# EasyEDA Pro project 40_keyboard.epro, board PCB7
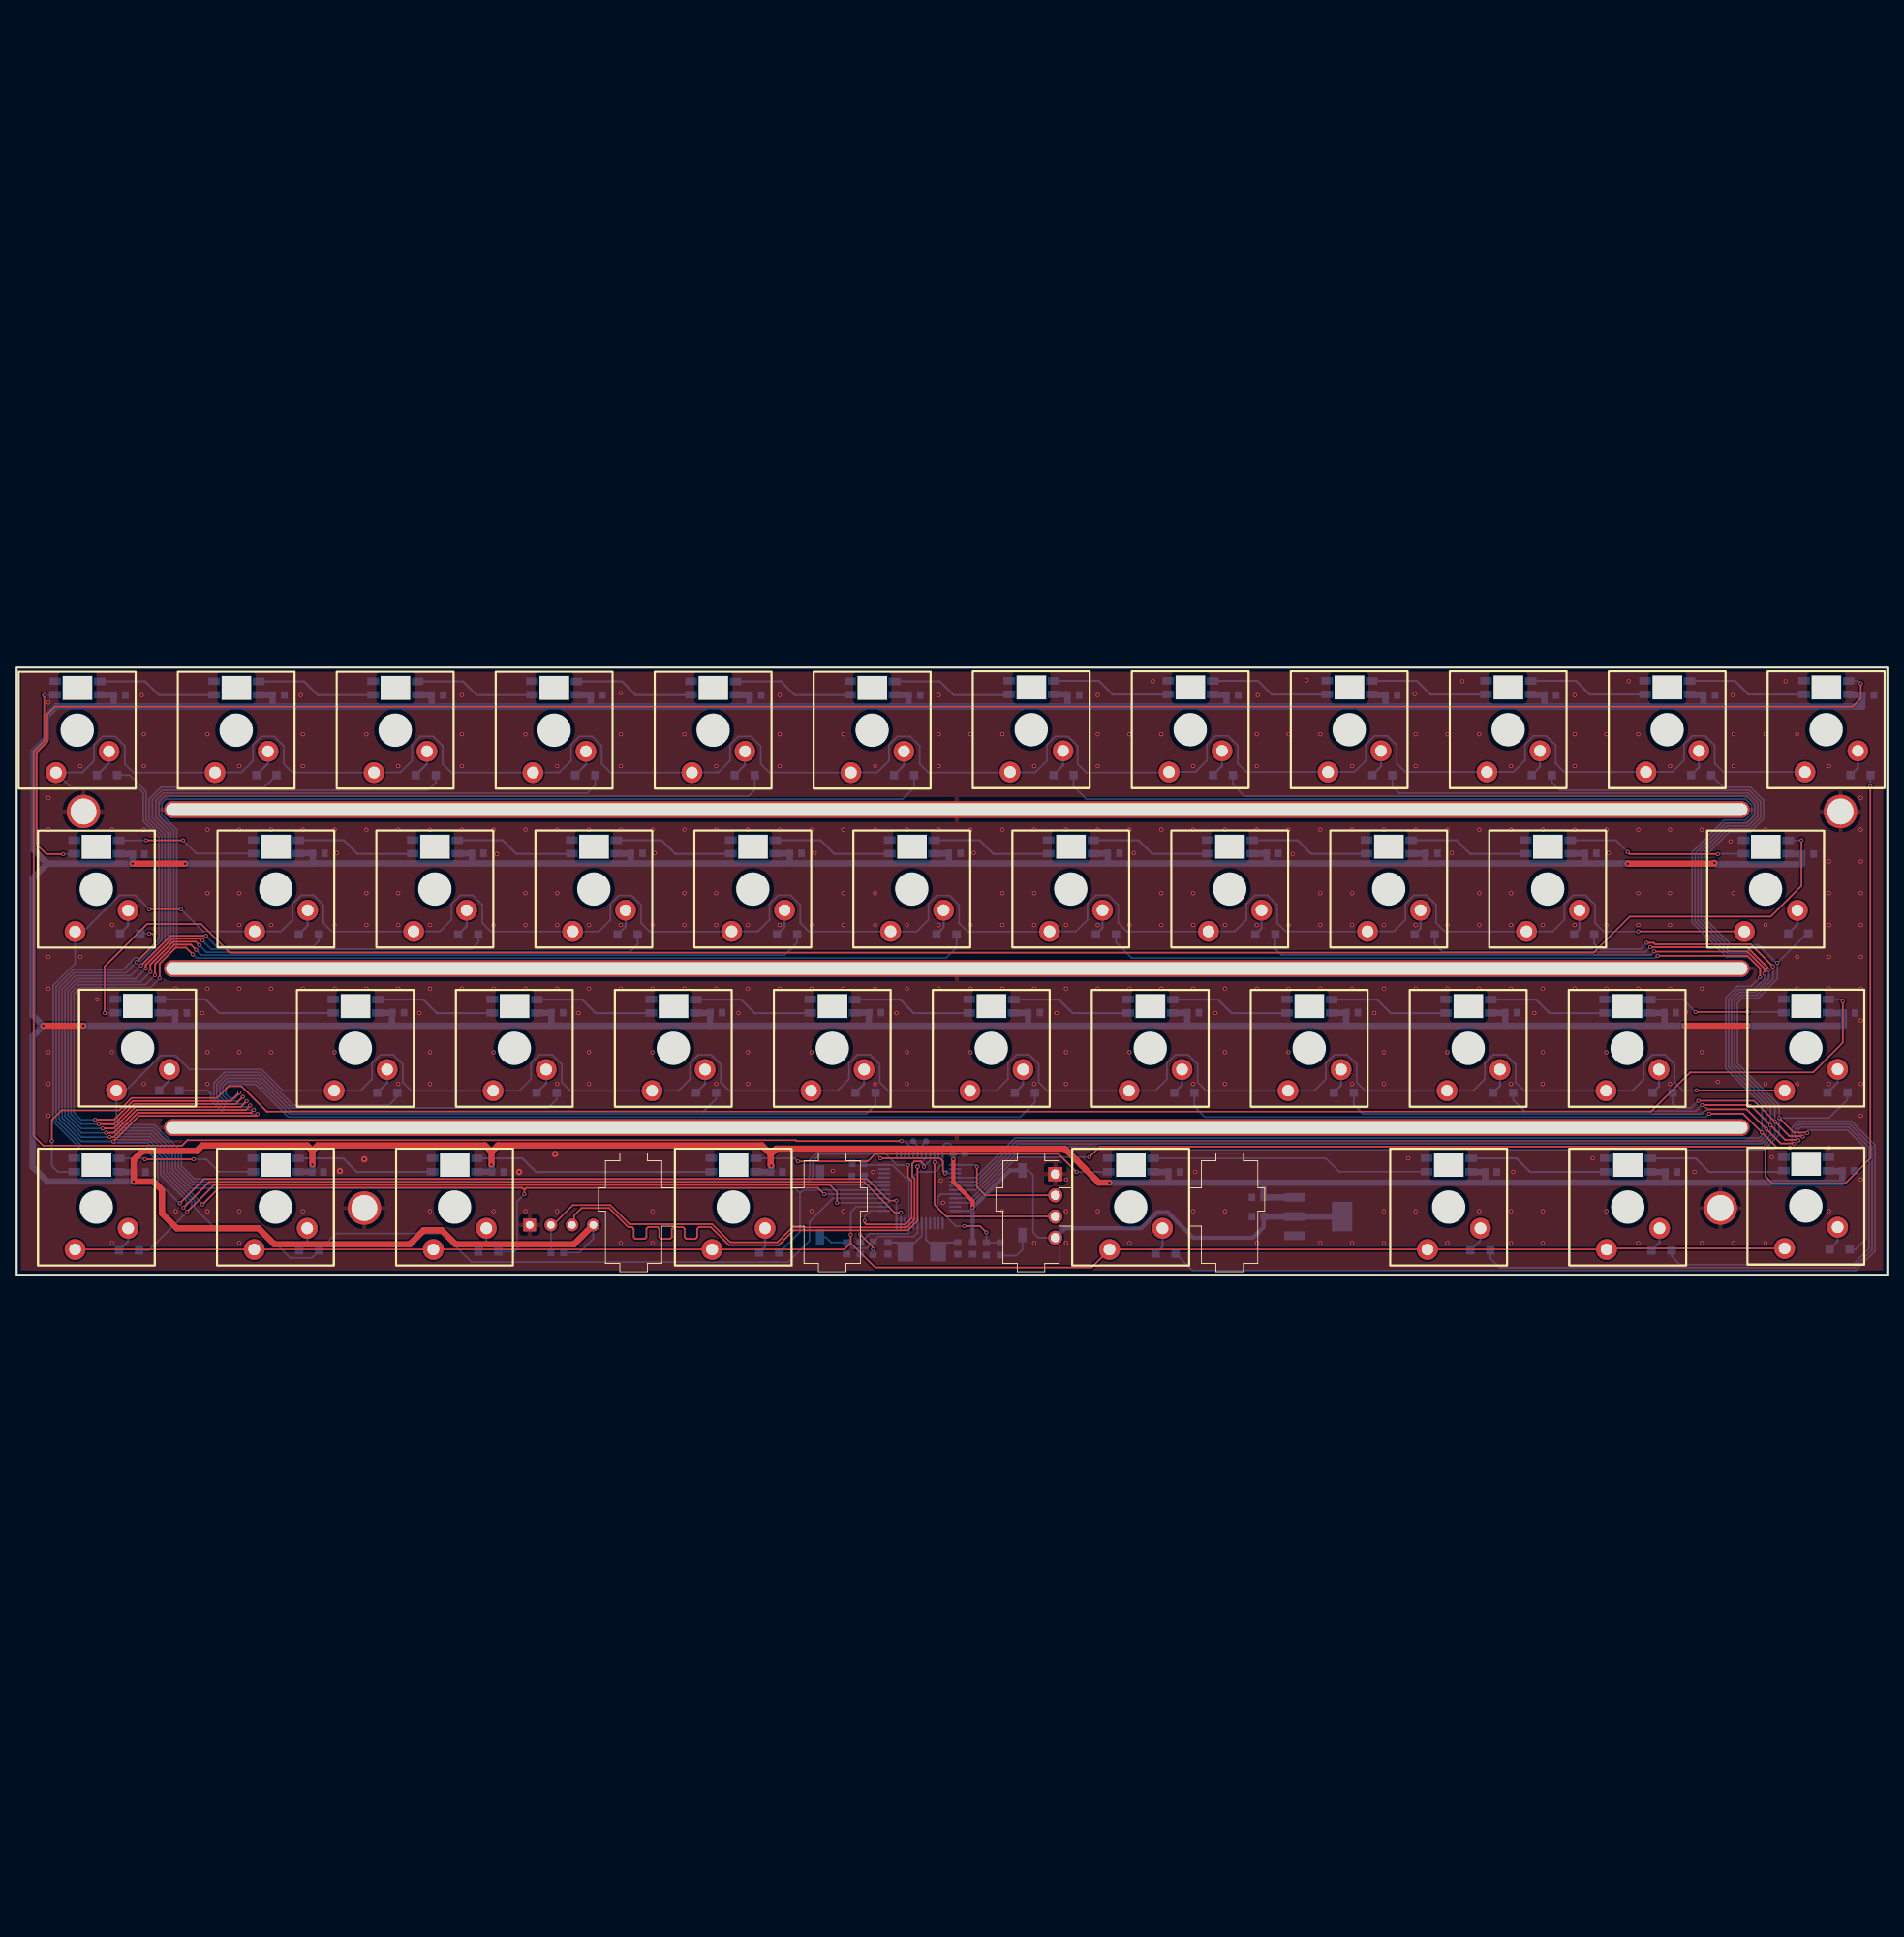
[diagram p2: board, top side]
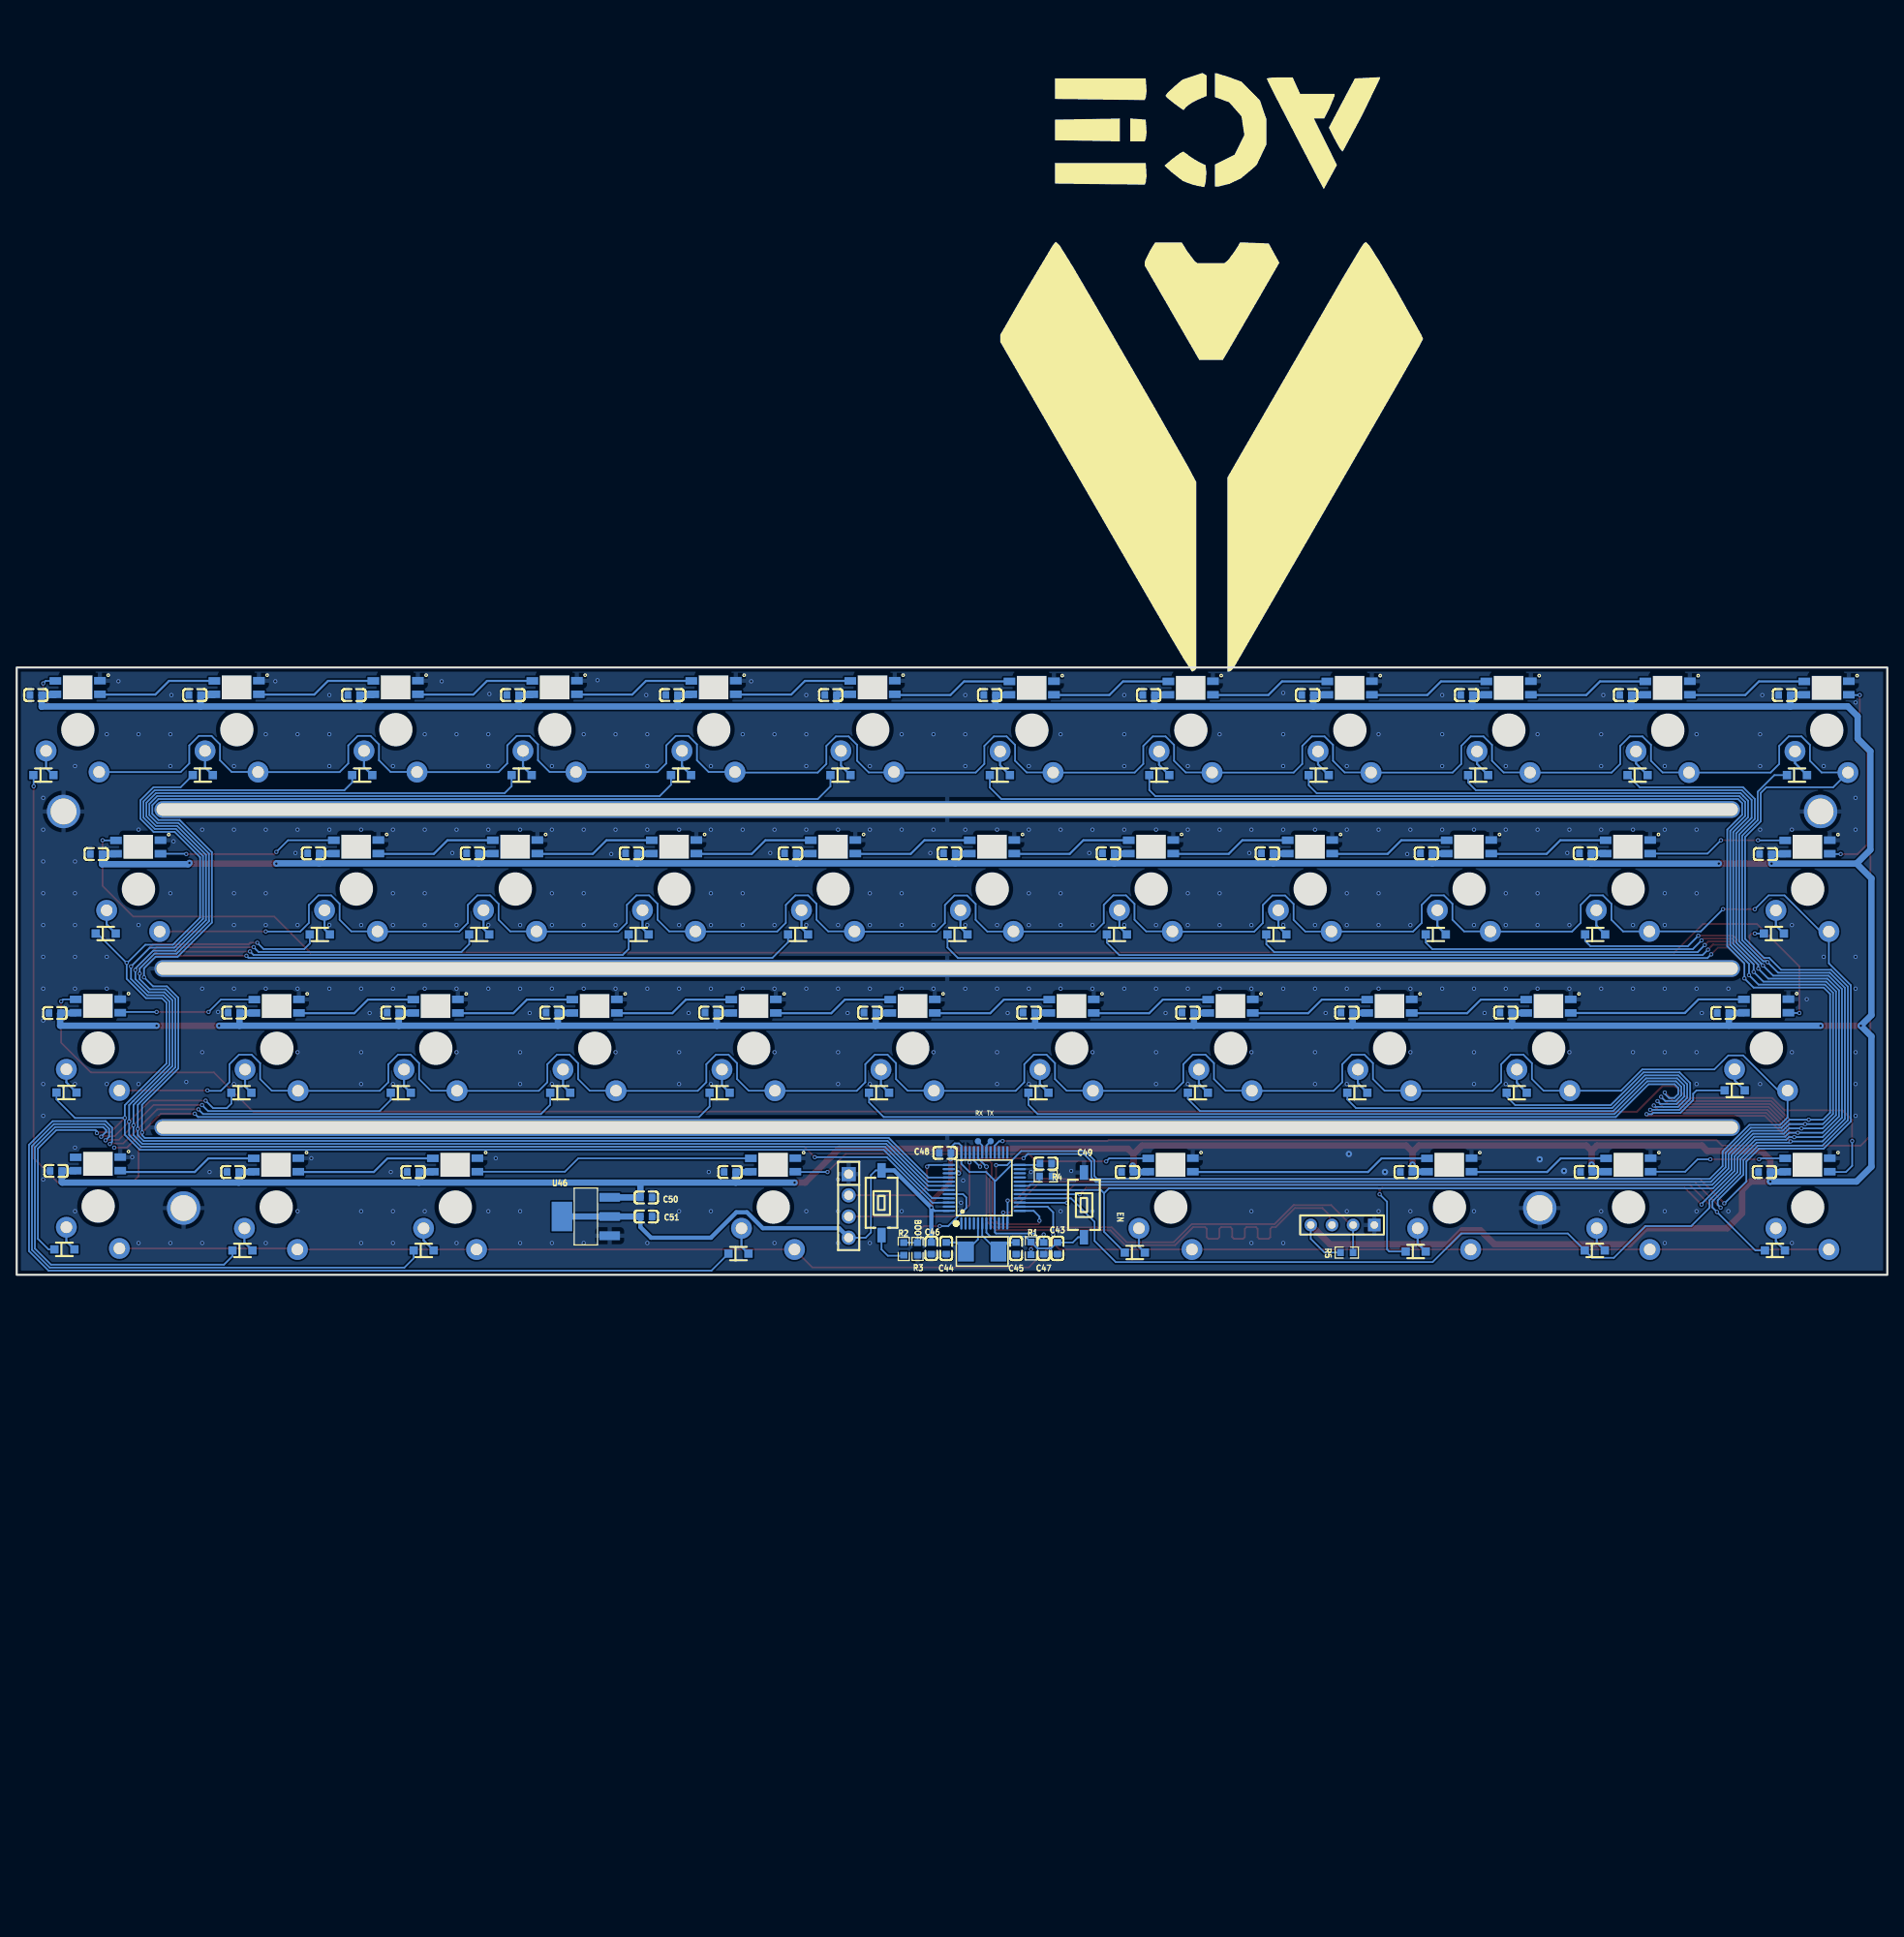
[diagram p3: board, bottom side, seen from below]

Outline 224.15 x 72.77 mm; copper layers: Top Layer, Bottom Layer. Coordinates in mm from the lower left corner of the outline.
Outline path: rectangle 0,72.77 224.15,0
Stack: Top Layer 0.035mm / Dielectric1 1.11mm FR4 er 4.5 / Bottom Layer 0.035mm

## Design rules (mm)
net D-: DP2
net D+: DP2
spacing safeClearance (default): track to track 0.152, other pairs 0.152 to 0.3
track width trackWidth (default): min 0.127, default 0.203, max 2.54
differential pair differentialPair (default): width min 0.127, default 0.254, max 2.54; gap min 0.152, default 0.152
via viaSize (default): diameter min 0.5, default 0.5, max 10; hole min 0.3, default 0.3, max 5.999

## Placement (name value [footprint] x y rotation side)
BOOT  -  [SW-SMD_L6.0-W3.7-LS8.0]  120.52 8.64 90 bottom
C1  100nF  [C0603]  221.86 69.47 0 bottom
C2  100nF  [C0603]  202.81 69.47 0 bottom
C3  100nF  [C0603]  183.76 69.47 0 bottom
C4  100nF  [C0603]  164.72 69.47 0 bottom
C5  100nF  [C0603]  145.67 69.47 0 bottom
C6  100nF  [C0603]  126.62 69.47 0 bottom
C7  100nF  [C0603]  107.57 69.47 0 bottom
C8  100nF  [C0603]  88.52 69.47 0 bottom
C9  100nF  [C0603]  69.47 69.47 0 bottom
C10  100nF  [C0603]  50.42 69.47 0 bottom
C11  100nF  [C0603]  31.37 69.47 0 bottom
C12  100nF  [C0603]  12.32 69.47 0 bottom
C13  100nF  [C0603]  214.63 50.42 0 bottom
C14  100nF  [C0603]  188.59 50.51 0 bottom
C15  100nF  [C0603]  169.54 50.51 0 bottom
C16  100nF  [C0603]  150.49 50.51 0 bottom
C17  100nF  [C0603]  131.44 50.51 0 bottom
C18  100nF  [C0603]  112.39 50.51 0 bottom
C19  100nF  [C0603]  93.34 50.51 0 bottom
C20  100nF  [C0603]  74.29 50.51 0 bottom
C21  100nF  [C0603]  55.24 50.51 0 bottom
C22  100nF  [C0603]  36.19 50.51 0 bottom
C23  100nF  [C0603]  14.6 50.42 0 bottom
C24  100nF  [C0603]  219.58 31.37 0 bottom
C25  100nF  [C0603]  198.12 31.42 0 bottom
C26  100nF  [C0603]  179.07 31.42 0 bottom
C27  100nF  [C0603]  160.02 31.42 0 bottom
C28  100nF  [C0603]  140.97 31.42 0 bottom
C29  100nF  [C0603]  121.92 31.42 0 bottom
C30  100nF  [C0603]  102.87 31.42 0 bottom
C31  100nF  [C0603]  83.82 31.42 0 bottom
C32  100nF  [C0603]  64.77 31.42 0 bottom
C33  100nF  [C0603]  45.72 31.42 0 bottom
C34  100nF  [C0603]  19.69 31.37 0 bottom
C35  100nF  [C0603]  219.46 12.45 0 bottom
C36  100nF  [C0603]  198.25 12.32 0 bottom
C37  100nF  [C0603]  176.66 12.32 0 bottom
C38  100nF  [C0603]  138.68 12.32 0 bottom
C39  100nF  [C0603]  91.06 12.32 0 bottom
C40  100nF  [C0603]  57.66 12.32 0 bottom
C41  100nF  [C0603]  36.07 12.32 0 bottom
C42  100nF  [C0603]  14.73 12.32 0 bottom
C43  100nF  [C0603]  99.44 3.17 90 bottom
C44  22pF  [C0603]  112.78 3.17 90 bottom
C45  22pF  [C0603]  104.39 3.17 90 bottom
C46  100nF  [C0603]  114.55 3.17 90 bottom
C47  100nF  [C0603]  101.09 3.17 90 bottom
C48  100nF  [C0603]  112.9 14.6 180 bottom
C49  100nF  [C0603]  100.84 13.33 0 bottom
C50  100nF  [C0603]  148.72 9.27 0 bottom
C51  100nF  [C0603]  148.72 6.98 0 bottom
D1  IN4148WS  [SOD-323_L1.8-W1.3-LS2.5-RD]  10.83 59.88 180 bottom
D2  IN4148WS  [SOD-323_L1.8-W1.3-LS2.5-RD]  29.93 59.88 180 bottom
D3  IN4148WS  [SOD-323_L1.8-W1.3-LS2.5-RD]  49.03 59.88 180 bottom
D4  IN4148WS  [SOD-323_L1.8-W1.3-LS2.5-RD]  68.13 59.88 180 bottom
D5  IN4148WS  [SOD-323_L1.8-W1.3-LS2.5-RD]  87.24 59.88 180 bottom
D6  IN4148WS  [SOD-323_L1.8-W1.3-LS2.5-RD]  106.34 59.88 180 bottom
D7  IN4148WS  [SOD-323_L1.8-W1.3-LS2.5-RD]  125.44 59.88 180 bottom
D8  IN4148WS  [SOD-323_L1.8-W1.3-LS2.5-RD]  144.55 59.88 180 bottom
D9  IN4148WS  [SOD-323_L1.8-W1.3-LS2.5-RD]  163.65 59.88 180 bottom
D10  IN4148WS  [SOD-323_L1.8-W1.3-LS2.5-RD]  182.75 59.88 180 bottom
D11  IN4148WS  [SOD-323_L1.8-W1.3-LS2.5-RD]  201.85 59.88 180 bottom
D12  IN4148WS  [SOD-323_L1.8-W1.3-LS2.5-RD]  220.96 59.88 180 bottom
D13  IN4148WS  [SOD-323_L1.8-W1.3-LS2.5-RD]  13.59 40.89 180 bottom
D14  IN4148WS  [SOD-323_L1.8-W1.3-LS2.5-RD]  35.01 40.78 180 bottom
D15  IN4148WS  [SOD-323_L1.8-W1.3-LS2.5-RD]  54.11 40.78 180 bottom
D16  IN4148WS  [SOD-323_L1.8-W1.3-LS2.5-RD]  73.21 40.78 180 bottom
D17  IN4148WS  [SOD-323_L1.8-W1.3-LS2.5-RD]  92.32 40.78 180 bottom
D18  IN4148WS  [SOD-323_L1.8-W1.3-LS2.5-RD]  111.42 40.78 180 bottom
D19  IN4148WS  [SOD-323_L1.8-W1.3-LS2.5-RD]  130.52 40.78 180 bottom
D20  IN4148WS  [SOD-323_L1.8-W1.3-LS2.5-RD]  149.63 40.78 180 bottom
D21  IN4148WS  [SOD-323_L1.8-W1.3-LS2.5-RD]  168.73 40.78 180 bottom
D22  IN4148WS  [SOD-323_L1.8-W1.3-LS2.5-RD]  187.83 40.78 180 bottom
D23  IN4148WS  [SOD-323_L1.8-W1.3-LS2.5-RD]  213.49 40.89 180 bottom
D24  IN4148WS  [SOD-323_L1.8-W1.3-LS2.5-RD]  18.29 22.1 180 bottom
D25  IN4148WS  [SOD-323_L1.8-W1.3-LS2.5-RD]  44.41 21.82 180 bottom
D26  IN4148WS  [SOD-323_L1.8-W1.3-LS2.5-RD]  63.51 21.82 180 bottom
D27  IN4148WS  [SOD-323_L1.8-W1.3-LS2.5-RD]  82.61 21.82 180 bottom
D28  IN4148WS  [SOD-323_L1.8-W1.3-LS2.5-RD]  101.72 21.82 180 bottom
D29  IN4148WS  [SOD-323_L1.8-W1.3-LS2.5-RD]  120.82 21.82 180 bottom
D30  IN4148WS  [SOD-323_L1.8-W1.3-LS2.5-RD]  139.92 21.82 180 bottom
D31  IN4148WS  [SOD-323_L1.8-W1.3-LS2.5-RD]  159.02 21.82 180 bottom
D32  IN4148WS  [SOD-323_L1.8-W1.3-LS2.5-RD]  178.13 21.82 180 bottom
D33  IN4148WS  [SOD-323_L1.8-W1.3-LS2.5-RD]  197.23 21.82 180 bottom
D34  IN4148WS  [SOD-323_L1.8-W1.3-LS2.5-RD]  218.19 21.84 180 bottom
D35  IN4148WS  [SOD-323_L1.8-W1.3-LS2.5-RD]  13.46 2.92 180 bottom
D36  IN4148WS  [SOD-323_L1.8-W1.3-LS2.5-RD]  35.05 2.92 180 bottom
D37  IN4148WS  [SOD-323_L1.8-W1.3-LS2.5-RD]  56.51 2.79 180 bottom
D38  IN4148WS  [SOD-323_L1.8-W1.3-LS2.5-RD]  90.17 2.67 180 bottom
D39  IN4148WS  [SOD-323_L1.8-W1.3-LS2.5-RD]  137.67 2.54 180 bottom
D40  IN4148WS  [SOD-323_L1.8-W1.3-LS2.5-RD]  175.39 2.92 180 bottom
D41  IN4148WS  [SOD-323_L1.8-W1.3-LS2.5-RD]  197.1 2.92 180 bottom
D42  IN4148WS  [SOD-323_L1.8-W1.3-LS2.5-RD]  218.44 3.05 180 bottom
EN  -  [SW-SMD_L6.0-W3.7-LS8.0]  96.27 8.38 90 bottom
H1  -  [HDR-TH_4P-P2.54-V-M]  124.46 8.25 270 bottom
NOREF  -  [Pad_e10192]  8 55.52 0 top
NOREF#2  -  [Pad_e10196]  218.54 55.52 0 top
NOREF#3  -  [Pad_e1166]  112.65 17.65 0 top
NOREF#4  -  [Pad_e10411]  41.65 8 0 top
NOREF#5  -  [Pad_e10409]  204.16 8 0 top
NOREF#6  -  [Pad_e1153]  112.65 55.75 0 top
NOREF#7  -  [Pad_e1165]  112.65 36.7 0 top
NOREF#8  -  [Pad_e2938]  108.97 16 0 top
NOREF#9  -  [Pad_e2936]  107.44 16 0 top
R1  10kΩ  [R0603]  102.62 3.17 90 bottom
R2  10kΩ  [R0603]  117.86 3.1 270 bottom
R3  10kΩ  [R0603]  116.2 3.1 270 bottom
R4  10kΩ  [R0603]  100.84 11.81 0 bottom
R5  4.7kΩ  [R0603]  64.77 2.67 180 bottom
U1  ESC  [反贴rgb仅焊接轴]  0.25 72.26 0 top
U2  Q  [反贴rgb仅焊接轴]  19.3 72.26 0 top
U3  W  [反贴rgb仅焊接轴]  38.35 72.26 0 top
U4  E  [反贴rgb仅焊接轴]  57.4 72.26 0 top
U5  R  [反贴rgb仅焊接轴]  76.45 72.26 0 top
U6  T  [反贴rgb仅焊接轴]  95.5 72.26 0 top
U7  Y  [反贴rgb仅焊接轴]  114.57 72.32 0 top
U8  U  [反贴rgb仅焊接轴]  133.62 72.32 0 top
U9  I  [反贴rgb仅焊接轴]  152.67 72.32 0 top
U10  O  [反贴rgb仅焊接轴]  171.72 72.32 0 top
U11  P  [反贴rgb仅焊接轴]  190.77 72.32 0 top
U12  BACKSPACE  [反贴rgb仅焊接轴]  209.82 72.32 0 top
U13  TAB  [反贴rgb仅焊接轴]  2.54 53.21 0 top
U14  A  [反贴rgb仅焊接轴]  24.06 53.23 0 top
U15  S  [反贴rgb仅焊接轴]  43.11 53.23 0 top
U16  D  [反贴rgb仅焊接轴]  62.16 53.23 0 top
U17  F  [反贴rgb仅焊接轴]  81.21 53.23 0 top
U18  G  [反贴rgb仅焊接轴]  100.26 53.23 0 top
U19  H  [反贴rgb仅焊接轴]  119.31 53.23 0 top
U20  J  [反贴rgb仅焊接轴]  138.36 53.23 0 top
U21  K  [反贴rgb仅焊接轴]  157.41 53.23 0 top
U22  L  [反贴rgb仅焊接轴]  176.46 53.23 0 top
U23  ENTER  [反贴rgb仅焊接轴]  202.56 53.21 0 top
U24  SHIFT  [反贴rgb仅焊接轴]  7.49 34.16 0 top
U25  Z  [反贴rgb仅焊接轴]  33.58 34.14 0 top
U26  X  [反贴rgb仅焊接轴]  52.63 34.14 0 top
U27  C  [反贴rgb仅焊接轴]  71.68 34.14 0 top
U28  V  [反贴rgb仅焊接轴]  90.73 34.14 0 top
U29  B  [反贴rgb仅焊接轴]  109.78 34.14 0 top
U30  N  [反贴rgb仅焊接轴]  128.83 34.14 0 top
U31  M  [反贴rgb仅焊接轴]  147.88 34.14 0 top
U32  &lt;  [反贴rgb仅焊接轴]  166.93 34.14 0 top
U33  FN  [反贴rgb仅焊接轴]  185.98 34.14 0 top
U34  SHIFT  [反贴rgb仅焊接轴]  207.39 34.16 0 top
U35  CTRL  [反贴rgb仅焊接轴]  2.54 15.11 0 top
U36  WIN  [反贴rgb仅焊接轴]  24 15.11 0 top
U37  ALT  [反贴rgb仅焊接轴]  45.47 15.11 0 top
U38  SPACE  [反贴rgb仅焊接轴]  78.87 15.11 0 top
U39  SPACE1  [反贴rgb仅焊接轴]  126.49 15.11 0 top
U40  ALT  [反贴rgb仅焊接轴]  164.59 15.11 0 top
U41  FN  [反贴rgb仅焊接轴]  186.06 15.11 0 top
U42  DEL  [反贴rgb仅焊接轴]  207.39 15.24 0 top
U44  -  [LQFP-48_L7.0-W7.0-P0.50-LS9.0-BL]  108.2 10.41 180 bottom
U46  -  [SOT-223_L6.5-W3.5-P2.30-LS7.0-BR]  155.96 6.98 180 bottom
U47  -  [TYPEC]  61.47 5.97 0 bottom
X1  8MHZ  [CRYSTAL-SMD_2P-L5.0-W3.2]  108.46 2.79 0 bottom

## Footprints (pads in the part's own frame, mm; a bottom-side part is the same pattern mirrored in y, then rotated)
C0603
  rect 0.8x0.9 smd: 1(-0.7,0) 2(0.7,0)
CRYSTAL-SMD_2P-L5.0-W3.2
  rect 1.9x2.401 smd: 1(-1.95,0) 2(1.95,0)
HDR-TH_4P-P2.54-V-M
  rect 1.7x1.7 hole 1.1: 1(-3.81,0)
  round 1.7 hole 1.1: 2(-1.27,0) 3(1.27,0) 4(3.81,0)
LQFP-48_L7.0-W7.0-P0.50-LS9.0-BL
  oval 0.27x1.5 smd: 1(-2.75,-4.25) 2(-2.25,-4.25) 3(-1.75,-4.25) 4(-1.25,-4.25) 5(-0.75,-4.25) 6(-0.25,-4.25) 7(0.25,-4.25) 8(0.75,-4.25) 9(1.25,-4.25) 10(1.75,-4.25) 11(2.25,-4.25) 12(2.75,-4.25) 25(2.75,4.25) 26(2.25,4.25) 27(1.75,4.25) 28(1.25,4.25) 29(0.75,4.25) 30(0.25,4.25) 31(-0.25,4.25) 32(-0.75,4.25) 33(-1.25,4.25) 34(-1.75,4.25) 35(-2.25,4.25) 36(-2.75,4.25)
  oval 1.5x0.27 smd: 13(4.25,-2.75) 14(4.25,-2.25) 15(4.25,-1.75) 16(4.25,-1.25) 17(4.25,-0.75) 18(4.25,-0.25) 19(4.25,0.25) 20(4.25,0.75) 21(4.25,1.25) 22(4.25,1.75) 23(4.25,2.25) 24(4.25,2.75) 37(-4.25,2.75) 38(-4.25,2.25) 39(-4.25,1.75) 40(-4.25,1.25) 41(-4.25,0.75) 42(-4.25,0.25) 43(-4.25,-0.25) 44(-4.25,-0.75) 45(-4.25,-1.25) 46(-4.25,-1.75) 47(-4.25,-2.25) 48(-4.25,-2.75)
Pad_e1153
  oval 190x2 hole 189.5x1.5: 1(0,0)
Pad_e1165
  oval 190x2 hole 189.5x1.5: 2(0,0)
Pad_e1166
  oval 190x2 hole 189.5x1.5: 2(0,0)
Pad_e2936
  round 0.762 smd far side: 1(0,0)
Pad_e2938
  round 0.762 smd far side: 2(0,0)
Pad_e10192
  round 4 hole 3.1: 1(0,0)
Pad_e10196
  round 4 hole 3.1: 2(0,0)
Pad_e10409
  round 4 hole 3.1: 3(0,0)
Pad_e10411
  round 4 hole 3.1: 4(0,0)
R0603
  rect 0.806x0.864 smd: 1(-0.753,0) 2(0.753,0)
SOD-323_L1.8-W1.3-LS2.5-RD
  rect 1x1 smd: 1(-1.2,0) 2(1.2,0)
SOT-223_L6.5-W3.5-P2.30-LS7.0-BR
  rect 2.465x1.05 smd: 1(2.857,-2.3) 2(2.857,0) 3(2.857,2.3)
  rect 2.465x3.54 smd: 4(-2.857,0)
SW-SMD_L6.0-W3.7-LS8.0
  rect 1.75x1.001 smd: 1(-3.876,0) 2(3.876,0)
TYPEC
  rect 1.524x1.524 hole 0.914: 1(0,0)
  round 1.524 hole 0.914: 2(2.54,0) 3(5.08,0) 4(7.62,0)
反贴rgb仅焊接轴
  rect 1.4x0.9 smd far side: 1(4.359,-1.133) 2(9.693,-2.758) 3(9.693,-1.158) 4(4.359,-2.758)
  round 2.499 hole 1.399: 5(4.46,-12.08) 6(10.81,-9.54)

## Nets
+3.3V: BOOT.2 C46.2 C47.2 C48.2 C49.2 C51.2 H1.4 R1.1 U44.9 U44.24 U44.36 U44.48 U46.2 U46.4
+5V: C1.1 C2.1 C3.1 C4.1 C5.1 C6.1 C7.1 C8.1 C9.1 C10.1 C11.1 C12.1 C13.1 C14.1 C15.1 C16.1 C17.1 C18.1 C19.1 C20.1 C21.1 C22.1 C23.1 C24.1 C25.1 C26.1 C27.1 C28.1 C29.1 C30.1 C31.1 C32.1 C33.1 C34.1 C35.1 C36.1 C37.1 C38.1 C39.1 C40.1 C41.1 C42.1 C50.2 R5.1 U1.2 U2.2 U3.2 U4.2 U5.2 U6.2 U7.2 U8.2 U9.2 U10.2 U11.2 U12.2 U13.2 U14.2 U15.2 U16.2 U17.2 U18.2 U19.2 U20.2 U21.2 U22.2 U23.2 U24.2 U25.2 U26.2 U27.2 U28.2 U29.2 U30.2 U31.2 U32.2 U33.2 U34.2 U35.2 U36.2 U37.2 U38.2 U39.2 U40.2 U41.2 U42.2 U46.3 U47.4
GND: C1.2 C2.2 C3.2 C4.2 C5.2 C6.2 C7.2 C8.2 C9.2 C10.2 C11.2 C12.2 C13.2 C14.2 C15.2 C16.2 C17.2 C18.2 C19.2 C20.2 C21.2 C22.2 C23.2 C24.2 C25.2 C26.2 C27.2 C28.2 C29.2 C30.2 C31.2 C32.2 C33.2 C34.2 C35.2 C36.2 C37.2 C38.2 C39.2 C40.2 C41.2 C42.2 C43.1 C44.1 C45.1 C46.1 C47.1 C48.1 C49.1 C50.1 C51.1 EN.2 H1.1 NOREF.1 NOREF#2.2 NOREF#3.2 NOREF#4.4 NOREF#5.3 NOREF#6.1 NOREF#7.2 R3.2 R4.1 U1.1 U2.1 U3.1 U4.1 U5.1 U6.1 U7.1 U8.1 U9.1 U10.1 U11.1 U12.1 U13.1 U14.1 U15.1 U16.1 U17.1 U18.1 U19.1 U20.1 U21.1 U22.1 U23.1 U24.1 U25.1 U26.1 U27.1 U28.1 U29.1 U30.1 U31.1 U32.1 U33.1 U34.1 U35.1 U36.1 U37.1 U38.1 U39.1 U40.1 U41.1 U42.1 U44.8 U44.23 U44.35 U44.47 U46.1 U47.1
BOOT0: R2.1 R3.1 U44.44
COL0: D1.1 D13.1 D24.1 D35.1 U44.15
COL1: D2.1 D14.1 D25.1 D36.1 U44.16
COL2: D3.1 D15.1 D26.1 D37.1 U44.17
COL3: D4.1 D16.1 D27.1 D38.1 U44.18
COL4: D5.1 D17.1 D28.1 U44.19
COL5: D6.1 D18.1 D29.1 U44.39
COL6: D7.1 D19.1 D30.1 U44.40
COL7: D8.1 D20.1 D31.1 D39.1 U44.41
COL8: D9.1 D21.1 D32.1 D40.1 U44.42
COL9: D10.1 D22.1 D33.1 D41.1 U44.43
COL10: D11.1 D23.1 D34.1 D42.1 U44.45
COL11: D12.1 U44.46
D+: R5.2 U44.33 U47.2
D-: U44.32 U47.3
NRST: C43.2 EN.1 R1.2 U44.7
OSC_IN: C44.2 U44.5 X1.2
OSC_OUT: C45.2 U44.6 X1.1
PB2: R4.2 U44.20
RGB: U1.4 U44.28
ROW0: U1.5 U2.5 U3.5 U4.5 U5.5 U6.5 U7.5 U8.5 U9.5 U10.5 U11.5 U12.5 U44.11
ROW1: U13.5 U14.5 U15.5 U16.5 U17.5 U18.5 U19.5 U20.5 U21.5 U22.5 U23.5 U44.12
ROW2: U24.5 U25.5 U26.5 U27.5 U28.5 U29.5 U30.5 U31.5 U32.5 U33.5 U34.5 U44.13
ROW3: U35.5 U36.5 U37.5 U38.5 U39.5 U40.5 U41.5 U42.5 U44.14
SWCLK: H1.2 U44.37
SWD: H1.3 U44.34
USART1_D: NOREF#8.2 U44.31
USART1_M: NOREF#9.1 U44.30
$1N412: D1.2 U1.6
$1N436: U1.3 U2.4
$1N912: D2.2 U2.6
$1N913: U2.3 U3.4
$1N1213: D3.2 U3.6
$1N1214: U3.3 U4.4
$1N1442: D4.2 U4.6
$1N1443: U4.3 U5.4
$1N1677: D5.2 U5.6
$1N1678: U5.3 U6.4
$1N1918: D6.2 U6.6
$1N2984: D13.2 U13.6
$1N2985: U13.3 U14.4
$1N2986: D14.2 U14.6
$1N2987: U14.3 U15.4
$1N2988: D15.2 U15.6
$1N2989: U15.3 U16.4
$1N2990: D16.2 U16.6
$1N2991: U16.3 U17.4
$1N2992: D17.2 U17.6
$1N2993: U17.3 U18.4
$1N2994: D18.2 U18.6
$1N4716: D24.2 U24.6
$1N4717: U24.3 U25.4
$1N4718: D25.2 U25.6
$1N4719: U25.3 U26.4
$1N4720: D26.2 U26.6
$1N4721: U26.3 U27.4
$1N4722: D27.2 U27.6
$1N4723: U27.3 U28.4
$1N4724: D28.2 U28.6
$1N4725: U28.3 U29.4
$1N4726: D29.2 U29.6
$1N5992: D35.2 U35.6
$1N5993: U35.3 U36.4
$1N5994: D36.2 U36.6
$1N5995: U36.3 U37.4
$1N5996: D37.2 U37.6
$1N5997: U37.3 U38.4
$1N5998: D38.2 U38.6
$1N13881: U6.3 U7.4
$1N13882: D7.2 U7.6
$1N14279: U7.3 U8.4
$1N14280: D8.2 U8.6
$1N14913: D9.2 U9.6
$1N15646: U8.3 U9.4
$1N15975: D10.2 U10.6
$1N15978: U9.3 U10.4
$1N16388: D11.2 U11.6
$1N16391: U10.3 U11.4
$1N16807: D12.2 U12.6
$1N16810: U11.3 U12.4
$1N18837: D19.2 U19.6
$1N18974: U18.3 U19.4
$1N19795: D20.2 U20.6
$1N19798: U19.3 U20.4
$1N20232: D21.2 U21.6
$1N20235: U20.3 U21.4
$1N20675: D22.2 U22.6
$1N20678: U21.3 U22.4
$1N21124: D23.2 U23.6
$1N21127: U22.3 U23.4
$1N22907: D30.2 U30.6
$1N23590: U29.3 U30.4
$1N23955: D31.2 U31.6
$1N23958: U30.3 U31.4
$1N24422: D32.2 U32.6
$1N24425: U31.3 U32.4
$1N24895: D33.2 U33.6
$1N24898: U32.3 U33.4
$1N25374: D34.2 U34.6
$1N25377: U33.3 U34.4
$1N25859: D39.2 U39.6
$1N26612: U38.3 U39.4
$1N26997: D40.2 U40.6
$1N27494: D41.2 U41.6
$1N27497: U40.3 U41.4
$1N27997: D42.2 U42.6
$1N28000: U41.3 U42.4
$1N28340: U12.3 U13.4
$1N28574: U23.3 U24.4
$1N28808: U34.3 U35.4
$1N36337: U39.3 U40.4
$2N10725: BOOT.1 R2.2

Pads without a net: U42 3; U44 1 2 3 4 10 21 22 25 26 27 29 38

## Via types
v1: diameter 0.5, hole 0.299, Top Layer to Bottom Layer, 334 vias
v2: diameter 0.5, hole 0.3, Top Layer to Bottom Layer, 155 vias
v3: diameter 0.762, hole 0.3, Top Layer to Bottom Layer, 4 vias

## Routing (per net, layer and track width the routed paths; a pad name or vN(x,y) marks a point on that pad's centre or on a via; arc(x,y) is an arc through that point)
+3.3V: length 104
  Top Layer w0.203: v2(102.62,3.05) 102.62,3.3 v2(101.09,4.83)
  Top Layer w0.508: v2(114.55,8.06) 114.55,8.81 112.24,11.12 v2(112.24,13.84)
  Bottom Layer w0.203: C49.2 101.71,13.16 U44.24 104.95,13.16 106.83,11.28 106.95,11.28 ; 106.95,11.28 107.99,12.32 109.98,12.32 110.95,13.29 U44.36 110.95,15.45 111.25,15.75 111.76,15.75 112.2,15.31 C48.2 ; 106.95,11.28 U44.9 106.93,6.14 106.93,5.08 106.81,4.95 102.22,4.95 101.14,3.88 101.09,3.88 v2(101.09,4.83) ; 120.52,12.7 BOOT.2 121.22,12.51 121.79,11.94 121.79,5.08 122.43,4.44 H1.4 ; R1.1 v2(102.62,3.05)
  Bottom Layer w0.254: U44.48 114.16,7.66 v2(114.55,8.06)
  Bottom Layer w0.508: BOOT.2 119.01,12.51 v2(114.55,8.06) 114.55,3.88 ; v2(112.24,13.84) 112.24,14.57 C48.2 ; C51.2 149.42,5.72 148.14,4.44 140.97,4.44 137.92,7.49 136.65,7.49 134.75,5.59 125.6,5.59 H1.4
  Bottom Layer w0.762: C51.2 U46.2 U46.4
+5V: length 1132.8
  Top Layer w0.762: 56.9,14.73 v2(56.9,13.21) ; 56.9,14.73 56.13,15.49 36.07,15.49 35.43,14.86 ; 56.9,14.73 57.66,15.49 89.31,15.49 90.35,14.45 ; v2(193.04,49.28) 203.38,49.28 v2(203.45,49.35) ; v2(199.9,29.84) v2(207.39,29.84) ; 90.35,14.45 90.35,13.16 v2(90.42,13.08) ; 90.35,14.45 91,15.11 125.61,15.11 129.67,11.05 v2(130.94,11.05) ; 35.43,14.86 v2(35.43,13.21) ; 35.43,14.86 34.8,15.49 22.23,15.49 21.58,14.85 15.1,14.85 14.02,13.77 v2(14.02,11.18) 16.38,11.18 17.4,10.16 17.4,7.37 19.19,5.58 28.96,5.58 30.88,3.67 47.1,3.67 48.77,5.33 50.93,5.33 52.59,3.67 66.79,3.67 U47.4 ; v2(3.17,29.84) v2(8,29.84) ; v2(13.87,49.28) v2(20.19,49.28)
  Bottom Layer w0.203: U47.4 69.09,4.32 67.44,2.67 R5.1
  Bottom Layer w0.762: v2(14.02,11.18) 3.68,11.18 1.91,12.95 1.91,28.57 v2(3.17,29.84) 1.91,31.11 1.91,47.5 3.68,49.28 ; v2(14.02,11.18) 14.02,12.31 C42.1 12.27,12.32 U35.2 ; v2(14.02,11.18) 14.05,11.15 ; U2.2 29.03,69.47 C11.1 30.67,68.11 30.66,68.1 ; 100.42,31.38 100.46,31.42 C30.1 102.11,31.36 102.11,29.84 ; 159.31,31.41 159.28,31.38 U31.2 ; 159.31,31.41 C27.1 ; 159.31,31.41 159.31,29.84 ; 125.93,68.1 125.92,68.11 C6.1 125.83,69.56 U7.2 ; 125.93,68.1 106.78,68.1 ; 125.93,68.1 144.99,68.1 ; 62.32,31.38 64.03,31.38 C32.1 64.07,29.88 64.1,29.84 ; v2(207.39,29.84) 218.95,29.84 218.95,31.3 C24.1 217.12,31.37 217.08,31.4 ; 195.67,31.38 197.38,31.38 C25.1 197.46,31.37 197.46,29.84 ; U9.2 162.46,69.47 C4.1 164.01,68.24 163.88,68.1 ; U8.2 143.41,69.47 C5.1 144.97,68.13 144.99,68.1 ; 178.36,29.84 178.36,31.41 178.33,31.38 U32.2 ; 178.36,29.84 197.46,29.84 ; 178.36,29.84 159.31,29.84 ; 183.02,68.1 183.06,68.14 C3.1 181.51,69.47 U10.2 ; 183.02,68.1 163.88,68.1 ; 183.02,68.1 202.11,68.1 ; 73.56,50.47 73.56,50.47 U16.2 ; 73.56,50.47 C20.1 ; 73.56,50.47 73.56,49.3 ; 130.71,49.3 149.81,49.3 ; 130.71,49.3 111.69,49.3 ; 130.71,49.3 130.74,49.33 C17.1 130.71,50.47 U19.2 ; 149.81,49.3 149.79,49.32 C16.1 149.75,50.47 U20.2 ; 149.81,49.3 168.8,49.3 ; 197.46,29.84 v2(199.9,29.84) ; v2(35.43,13.21) 35.43,12.39 C41.1 35.34,12.35 U36.2 ; 138,11.05 175.97,11.05 ; 138,11.05 138,12.31 137.98,12.32 136.22,12.32 U39.2 ; 138,11.05 v2(130.94,11.05) ; 175.97,11.05 175.97,12.31 C37.1 174.32,12.32 U40.2 ; 175.97,11.05 197.54,11.05 ; U4.2 67.13,69.47 C9.1 68.78,69.46 68.78,68.1 ; 168.8,50.47 C15.1 ; 168.8,50.47 168.8,50.47 168.8,49.3 ; 168.8,50.47 U21.2 ; 202.11,68.1 202.11,68.11 C2.1 200.56,69.47 U11.2 ; 202.11,68.1 221.13,68.1 221.16,68.07 221.16,69.47 C1.1 219.61,69.47 U12.2 ; U6.2 105.23,69.47 C7.1 106.87,68.18 106.78,68.1 ; 87.77,68.1 106.78,68.1 ; 87.77,68.1 68.78,68.1 ; 87.77,68.1 87.82,68.14 C8.1 86.18,69.47 U5.2 ; 163.88,68.1 144.99,68.1 ; 11.62,68.11 C12.1 11.59,69.5 U1.2 ; 11.62,68.11 11.63,68.1 30.66,68.1 ; 11.62,68.11 4.74,68.11 3.56,66.93 3.56,64.26 2.03,62.74 2.03,50.93 3.68,49.28 ; 187.92,49.3 193.01,49.3 v2(193.04,49.28) ; 187.92,49.3 168.8,49.3 ; 187.92,49.3 187.92,50.48 C14.1 187.85,50.47 U22.2 ; 140.25,29.84 159.31,29.84 ; 140.25,29.84 140.27,29.86 C28.1 140.23,31.38 U30.2 ; 140.25,29.84 121.26,29.84 ; 56.92,12.35 56.96,12.32 ; 56.92,12.35 56.9,12.38 v2(56.9,13.21) ; 56.92,12.35 U37.2 ; 44.98,31.38 44.95,31.35 44.95,29.84 ; 44.98,31.38 C33.1 ; 44.98,31.38 U25.2 ; 102.11,29.84 83.09,29.84 ; 102.11,29.84 121.26,29.84 ; 68.78,68.1 49.7,68.1 ; 149.42,10.94 C50.2 153.08,9.27 U46.3 ; U18.2 111.66,50.47 111.69,50.51 ; 197.54,11.05 197.54,12.32 C36.1 195.78,12.32 U41.2 ; 197.54,11.05 218.69,11.05 218.76,11.11 218.76,12.45 217.12,12.45 U42.2 ; U38.2 88.59,12.32 C39.1 90.42,12.38 v2(90.42,13.08) ; 111.69,49.3 92.62,49.3 ; 111.69,49.3 111.69,50.51 ; 92.62,49.3 92.64,49.32 C19.1 92.61,50.47 U17.2 ; 92.62,49.3 73.56,49.3 ; U15.2 54.51,50.47 C21.1 54.54,49.31 54.53,49.3 ; 111.69,50.51 C18.1 ; U23.2 212.29,50.42 C13.1 213.93,49.21 213.92,49.2 203.61,49.2 v2(203.45,49.35) ; 44.95,29.84 64.1,29.84 ; 44.95,29.84 v2(8,29.84) ; 64.1,29.84 83.09,29.84 ; 17.19,31.4 17.22,31.37 C34.1 18.98,29.85 ; 35.48,49.3 35.48,50.5 C22.1 33.79,50.51 U14.2 ; 35.48,49.3 54.53,49.3 ; 35.48,49.3 35.46,49.28 v2(20.19,49.28) ; 30.66,68.1 49.7,68.1 ; 83.09,29.84 83.09,31.39 ; 121.26,29.84 121.22,29.89 C29.1 121.18,31.38 U29.2 ; C31.1 83.09,31.39 ; 83.09,31.39 83.08,31.38 U27.2 ; 3.68,49.28 v2(13.87,49.28) 13.89,49.3 13.89,50.41 C23.1 12.27,50.42 U13.2 ; U3.2 48.08,69.47 C10.1 49.72,68.12 49.7,68.1 ; 54.53,49.3 73.56,49.3
GND:
  vias: v1(3.81,68.58) v1(3.81,57.15) v1(3.81,53.34) v1(3.81,38.1) v1(3.81,34.29) v1(3.81,26.67) v1(3.81,22.86) v1(3.81,19.05) v1(7.62,60.96) v1(7.62,38.1) v1(11.43,53.34) v1(11.43,41.91) v1(11.43,26.67) v1(11.43,3.81) v1(15.24,64.77) v1(15.24,60.96) v1(15.24,53.34) v1(15.24,22.86) v1(19.05,34.29) v1(19.05,7.62) v1(22.86,64.77) v1(22.86,53.34) v1(22.86,45.72) v1(22.86,34.29) v1(22.86,26.67) v1(22.86,22.86) v1(22.86,7.62) v1(26.67,60.96) v1(26.67,53.34) v1(26.67,45.72) v1(26.67,41.91) v1(26.67,34.29) v1(26.67,26.67) v1(26.67,7.62) v1(26.67,3.81) v1(30.48,53.34) v1(30.48,41.91) v1(30.48,34.29) v1(30.48,26.67) v1(34.29,64.77) v1(34.29,60.96) v1(34.29,53.34) v1(34.29,34.29) v1(34.29,7.62) v1(38.1,53.34) v1(38.1,41.91) v1(38.1,34.29) v1(38.1,26.67) v1(41.91,64.77) v1(41.91,53.34) v1(41.91,45.72) v1(41.91,41.91) v1(41.91,34.29) v1(45.72,60.96) v1(45.72,53.34) v1(45.72,45.72) v1(45.72,41.91) v1(45.72,34.29) v1(45.72,22.86) v1(49.53,53.34) v1(49.53,41.91) v1(49.53,34.29) v1(49.53,26.67) v1(49.53,22.86) v1(49.53,7.62) v1(53.34,64.77) v1(53.34,60.96) v1(53.34,53.34) v1(53.34,34.29) v1(57.15,53.34) v1(57.15,41.91) v1(57.15,34.29) v1(57.15,26.67) v1(57.15,7.62) v1(60.96,64.77) v1(60.96,53.34) v1(60.96,45.72) v1(60.96,41.91) v1(60.96,34.29) v1(60.96,7.62) v1(64.77,60.96) v1(64.77,53.34) v1(64.77,45.72) v1(64.77,41.91) v1(64.77,34.29) v1(64.77,22.86) v1(64.77,7.62) v1(68.58,53.34) v1(68.58,41.91) v1(68.58,34.29) v1(68.58,26.67) v1(68.58,22.86) v1(72.39,64.77) v1(72.39,60.96) v1(72.39,53.34) v1(72.39,41.91) v1(72.39,34.29) v1(72.39,3.81) v1(76.2,53.34) v1(76.2,41.91) v1(76.2,34.29) v1(76.2,26.67) v1(76.2,7.62) v1(76.2,3.81) v1(80.01,64.77) v1(80.01,53.34) v1(80.01,45.72) v1(80.01,41.91) v1(80.01,34.29) v1(83.82,60.96) v1(83.82,53.34) v1(83.82,45.72) v1(83.82,41.91) v1(83.82,34.29) v1(83.82,22.86) v1(87.63,53.34) v1(87.63,41.91) v1(87.63,34.29) v1(87.63,26.67) v1(87.63,22.86) v1(91.44,64.77) v1(91.44,60.96) v1(91.44,53.34) v1(91.44,41.91) v1(91.44,34.29) v1(95.25,53.34) v1(95.25,41.91) v1(95.25,34.29) v1(95.25,26.67) v1(95.25,7.62) v1(99.06,64.77) v1(99.06,53.34) v1(99.06,45.72) v1(99.06,41.91) v1(99.06,34.29) v1(99.06,7.62) v1(102.87,60.96) v1(102.87,53.34) v1(102.87,45.72) v1(102.87,41.91) v1(102.87,34.29) v1(102.87,22.86) v1(106.68,53.34) v1(106.68,41.91) v1(106.68,34.29) v1(106.68,26.67) v1(106.68,22.86) v1(110.49,64.77) v1(110.49,60.96) v1(110.49,53.34) v1(110.49,41.91) v1(110.49,34.29) v1(110.74,11.3) v1(114.3,64.77) v1(114.3,53.34) v1(114.3,41.91) v1(114.3,34.29) v1(114.3,26.67) v1(118.11,64.77) v1(118.11,53.34) v1(118.11,45.72) v1(118.11,41.91) v1(118.11,34.29) v1(118.11,7.62) v1(121.92,60.96) v1(121.92,53.34) v1(121.92,45.72) v1(121.92,41.91) v1(121.92,34.29) v1(121.92,22.86) v1(121.92,3.81) v1(125.73,53.34) v1(125.73,41.91) v1(125.73,34.29) v1(125.73,26.67) v1(125.73,22.86) v1(125.73,11.43) v1(125.73,7.62) v1(125.73,3.81) v1(129.54,64.77) v1(129.54,60.96) v1(129.54,53.34) v1(129.54,41.91) v1(129.54,34.29) v1(129.54,7.62) v1(133.35,64.77) v1(133.35,53.34) v1(133.35,41.91) v1(133.35,34.29) v1(133.35,26.67) v1(133.35,3.81) v1(137.16,64.77) v1(137.16,53.34) v1(137.16,45.72) v1(137.16,41.91) v1(137.16,34.29) v1(140.97,60.96) v1(140.97,53.34) v1(140.97,45.72) v1(140.97,41.91) v1(140.97,34.29) v1(140.97,22.86) v1(140.97,7.62) v1(144.78,53.34) v1(144.78,41.91) v1(144.78,34.29) v1(144.78,26.67) v1(144.78,22.86) v1(144.78,7.62) v1(148.59,64.77) v1(148.59,60.96) v1(148.59,53.34) v1(148.59,41.91) v1(148.59,34.29) v1(148.59,3.81) v1(152.4,64.77) v1(152.4,53.34) v1(152.4,41.91) v1(152.4,34.29) v1(152.4,26.67) v1(156.21,64.77) v1(156.21,53.34) v1(156.21,45.72) v1(156.21,41.91) v1(156.21,34.29) v1(156.21,3.81) v1(160.02,60.96) v1(160.02,53.34) v1(160.02,45.72) v1(160.02,41.91) v1(160.02,34.29) v1(160.02,22.86) v1(160.02,3.81) v1(163.83,53.34) v1(163.83,41.91) v1(163.83,34.29) v1(163.83,26.67) v1(163.83,22.86) v1(163.83,7.62) v1(163.83,3.81) v1(167.64,64.77) v1(167.64,60.96) v1(167.64,53.34) v1(167.64,41.91) v1(167.64,34.29) v1(167.64,7.62) v1(171.45,64.77) v1(171.45,53.34) v1(171.45,41.91) v1(171.45,34.29) v1(171.45,26.67) v1(171.45,3.81) v1(175.26,64.77) v1(175.26,53.34) v1(175.26,45.72) v1(175.26,41.91) v1(175.26,34.29) v1(175.26,7.62) v1(179.07,60.96) v1(179.07,53.34) v1(179.07,45.72) v1(179.07,41.91) v1(179.07,34.29) v1(179.07,22.86) v1(179.07,7.62) v1(179.07,3.81) v1(182.88,53.34) v1(182.88,41.91) v1(182.88,34.29) v1(182.88,26.67) v1(182.88,22.86) v1(182.88,7.62) v1(182.88,3.81) v1(186.69,64.77) v1(186.69,60.96) v1(186.69,53.34) v1(186.69,41.91) v1(186.69,34.29) v1(190.5,64.77) v1(190.5,53.34) v1(190.5,41.91) v1(190.5,34.29) v1(190.5,26.67) v1(190.5,7.62) v1(194.31,64.77) v1(194.31,53.34) v1(194.31,45.72) v1(194.31,41.91) v1(194.31,34.29) v1(194.31,3.81) v1(198.12,60.96) v1(198.12,53.34) v1(198.12,45.72) v1(198.12,41.91) v1(198.12,34.29) v1(198.12,22.86) v1(201.93,53.34) v1(201.93,34.29) v1(201.93,26.67) v1(201.93,3.81) v1(203.83,23.11) v1(205.74,64.77) v1(205.74,60.96) v1(205.74,45.72) v1(205.74,3.81) v1(209.55,64.77) v1(209.55,53.34) v1(209.55,41.91) v1(209.55,22.86) v1(209.55,3.81) v1(213.36,64.77) v1(213.36,38.1) v1(213.36,34.29) v1(213.36,22.86) v1(217.17,60.96) v1(217.17,49.53) v1(217.17,45.72) v1(217.17,41.91) v1(217.17,38.1) v1(217.17,34.29) v1(217.17,22.86) v1(217.17,15.24) v1(217.17,7.62) v1(220.98,57.15) v1(220.98,53.34) v1(220.98,49.53) v1(220.98,45.72) v1(220.98,41.91) v1(220.98,38.1) v1(220.98,34.29) v1(220.98,30.48) v1(220.98,22.86) v1(220.98,19.05) v1(220.98,11.43) v2(9.65,33.02) v2(14.99,69.47) v2(22.23,31.37) v2(34.04,69.47) v2(38.35,50.55) v2(48.26,31.37) v2(53.34,69.47) v2(57.53,50.42) v2(67.31,31.37) v2(72.39,69.72) v2(76.45,50.55) v2(86.49,31.37) v2(91.44,69.47) v2(95.63,50.55) v2(97.79,12.45) v2(102.62,12.32) v2(105.41,31.37) v2(110.49,69.47) v2(111,8.64) v2(114.68,50.55) v2(124.59,31.37) v2(129.54,69.47) v2(133.86,50.55) v2(136.14,71.12) v2(141.22,12.32) v2(143.64,31.37) v2(148.72,69.47) v2(152.91,50.42) v2(154.56,71.25) v2(162.69,31.37) v2(166.75,13.97) v2(167.51,69.6) v2(171.96,50.55) v2(173.23,71.12) v2(179.32,12.32) v2(181.86,31.37) v2(186.69,69.47) v2(188.85,13.97) v2(190.75,50.55) v2(193.17,71.12) v2(200.03,31.5) v2(201.04,12.32) v2(205.36,51.94) v2(205.61,69.47) v2(210.31,14.1) v2(211.96,71.12) v3(38.74,12.45) v3(41.66,13.84) v3(60.2,12.32) v3(64.52,14.48)
BOOT0: length 13.4
  Top Layer w0.203: v2(116.2,5.08) 115.44,5.84 v2(113.54,5.84)
  Bottom Layer w0.203: 117.86,3.86 116.2,3.86 v2(116.2,5.08) ; U44.44 110.76,9.66 110.36,9.27 110.36,8 112.52,5.84 v2(113.54,5.84)
COL0: length 205.5
  Top Layer w0.203: v2(14.35,37.46) 16.51,39.62 16.51,40.64 16.26,40.89 v2(15.88,40.89) ; v2(98.3,8.64) 98.3,9.91 97.42,10.78 23.66,10.78 v2(20.41,7.53) ; v2(28.85,19.25) 28.65,19.05 14.66,19.05 v2(11.59,15.98)
  Bottom Layer w0.203: D1.1 13.53,59.88 15.52,57.89 15.52,54.48 17.4,52.6 17.4,40.11 14.87,37.58 14.47,37.58 v2(14.35,37.46) 13.08,36.19 6.88,36.19 5.08,34.39 5.08,18.67 7.77,15.98 v2(11.59,15.98) 11.74,15.84 15.65,15.84 17.6,13.88 17.6,12.15 20.95,8.79 20.95,8.08 20.41,7.53 ; v2(28.85,19.25) 28.22,19.25 28.06,19.41 24.78,19.41 23.27,20.93 23.27,21.69 22.86,22.1 19.49,22.1 ; U44.15 103.93,8.64 v2(98.3,8.64) ; D35.1 15.8,2.92 v2(20.41,7.53) 20.41,7.53 ; 20.41,7.53 20.41,7.58 ; D13.1 v2(15.88,40.89)
COL1: length 253.8
  Top Layer w0.203: v2(14.91,37.08) 18.45,40.62 v2(22.65,40.62) ; v2(11.16,16.5) 11.61,16.5 14.51,19.41 28.05,19.41 v2(28.41,19.77)
  Bottom Layer w0.203: U44.16 97.81,9.16 95,6.35 95,4.06 92.46,1.52 54.48,1.52 51.05,4.95 38.28,4.95 D36.1 35.36,2.03 32.77,2.03 28.96,5.84 23.49,5.84 21.31,8.03 21.31,8.94 17.96,12.29 17.96,14.03 15.8,16.19 12.1,16.19 11.79,16.5 v2(11.16,16.5) 7.75,16.5 5.44,18.82 5.44,34.24 7.03,35.84 13.67,35.84 v2(14.91,37.08) 15.11,37.28 15.11,37.31 17.75,39.96 17.75,52.75 15.88,54.63 15.88,57.02 17.29,58.43 29.68,58.43 D2.1 ; 45.61,21.82 45.61,21.35 44.59,20.33 33.14,20.33 29.21,24.26 24.89,24.26 23.62,22.99 23.62,21.08 24.93,19.77 v2(28.41,19.77) ; v2(22.65,40.62) 23.9,39.38 35.57,39.38 36.21,40.02 D14.1
COL2: length 310.6
  Top Layer w0.203: v2(10.72,17.02) 11.63,17.02 14.37,19.76 27.45,19.76 v2(27.98,20.29) ; v2(96.77,9.65) 96.01,10.41 61.09,10.41 60.83,10.16 ; v2(22.27,40.07) 22.07,40.27 18.6,40.27 15.46,37.13 v2(15.46,36.69) ; 60.83,10.16 v2(60.83,9.65) ; 60.83,10.16 60.57,10.42 24.26,10.42 v2(22.26,8.42)
  Bottom Layer w0.203: D26.1 64.71,21.02 63.66,19.97 32.99,19.97 29.06,23.9 25.04,23.9 23.98,22.84 23.98,21.22 25.08,20.12 27.81,20.12 v2(27.98,20.29) ; v2(60.83,9.65) 59.94,8.76 59.94,3.05 59.69,2.79 D37.1 ; v2(96.77,9.65) 103.94,9.65 U44.17 ; v2(22.27,40.07) 23.31,39.02 54.52,39.02 55.31,39.82 D15.1 ; v2(22.26,8.42) 22.26,8.5 18.31,12.44 18.31,14.18 15.94,16.55 12.25,16.55 11.77,17.02 v2(10.72,17.02) 7.74,17.02 5.79,18.97 5.79,34.1 7.18,35.48 14.26,35.48 v2(15.46,36.69) 15.46,37.16 18.11,39.81 18.11,52.9 16.26,54.75 16.26,56.9 17.43,58.07 49.31,58.07 50.23,58.99 D3.1
COL3: length 362.5
  Top Layer w0.203: v2(27.54,20.81) 26.85,20.12 14.22,20.12 11.64,17.54 v2(10.29,17.54) ; v2(16.02,36.3) 16.02,37.18 18.75,39.91 21.48,39.91 v2(21.88,39.51)
  Bottom Layer w0.203: D27.1 83.81,21.07 82.36,19.62 32.84,19.62 28.91,23.55 25.19,23.55 24.33,22.69 24.33,21.37 25.23,20.48 27.21,20.48 v2(27.54,20.81) ; 93.85,9.78 93.85,5.15 91.37,2.67 ; 93.85,9.78 93.26,10.37 20.89,10.37 18.67,12.59 18.67,14.33 16.09,16.9 12.39,16.9 11.76,17.54 v2(10.29,17.54) 7.74,17.54 6.15,19.13 6.15,33.95 7.33,35.13 14.85,35.13 v2(16.02,36.3) 16.02,37.22 18.47,39.66 18.47,53.05 16.68,54.83 16.68,56.81 17.27,57.39 17.27,57.4 17.59,57.72 68.39,57.72 69.33,58.67 69.33,59.88 ; 93.85,9.78 94.23,10.16 103.95,10.16 U44.18 ; 74.41,40.78 74.41,39.62 73.47,38.67 22.72,38.67 v2(21.88,39.51)
COL4: length 409.6
  Top Layer w0.203: v2(16.57,35.91) 16.57,37.23 18.9,39.56 20.89,39.56 v2(21.49,38.96) ; v2(9.85,18.06) 9.87,18.05 11.64,18.05 14.07,20.47 26.25,20.47 v2(27.11,21.32)
  Bottom Layer w0.203: v2(21.49,38.96) 22.13,38.31 92.03,38.31 93.52,39.8 D17.1 ; U44.19 102.85,10.66 102.73,10.78 20.98,10.78 19.02,12.74 19.02,14.47 16.24,17.26 12.54,17.26 11.74,18.06 v2(9.85,18.06) 7.72,18.06 6.5,19.28 6.5,33.8 7.47,34.77 15.43,34.77 v2(16.57,35.91) 16.57,37.27 18.82,39.52 18.82,53.19 17.04,54.97 17.04,56.66 17.74,57.36 87.72,57.36 88.44,58.08 D5.1 ; v2(27.11,21.32) 26.62,20.83 25.37,20.83 24.69,21.52 24.69,22.54 25.33,23.19 28.76,23.19 32.69,19.26 101.81,19.26 102.91,20.36 D28.1
COL5: length 477.5
  Top Layer w0.203: v2(9.42,18.58) 11.68,18.58 13.92,20.83 25.65,20.83 v2(26.67,21.84) ; v2(21.1,38.4) 20.3,39.2 19.04,39.2 17.13,37.29 v2(17.13,35.52) ; v2(103.5,13.97) 103.51,13.97 110.62,13.97 111,13.59 111,12.42 v2(111.25,12.17)
  Bottom Layer w0.203: U44.39 112.45,12.17 v2(111.25,12.17) ; D18.1 112.62,39.21 111.36,37.96 21.54,37.96 v2(21.1,38.4) ; D6.1 107.54,58.39 106.16,57.01 17.89,57.01 17.4,56.51 17.4,55.12 19.18,53.34 19.18,39.37 17.13,37.32 v2(17.13,35.52) 16.02,34.42 7.62,34.42 6.86,33.65 6.86,19.43 7.7,18.58 v2(9.42,18.58) 11.72,18.58 12.69,17.61 16.39,17.61 19.38,14.62 19.38,12.88 21.13,11.14 94.83,11.14 95.38,11.68 95.38,13.59 96.27,14.48 103,14.48 v2(103.5,13.97) ; D29.1 122.02,20.67 120.25,18.91 32.54,18.91 28.62,22.83 25.48,22.83 25.04,22.4 25.04,21.67 25.52,21.19 26.16,21.19 26.67,21.7 v2(26.67,21.84)
  Bottom Layer w0.508: v2(111.25,12.17) 111.41,12.33
COL6: length 391.8
  Top Layer w0.203: 196.63,38.23 207.39,38.23 208.91,36.71 208.91,35.66 v2(208.9,35.65) ; v2(212.47,15.24) 210.94,15.24 v2(209.12,17.05) 206.87,19.31 v2(202.82,19.31)
  Bottom Layer w0.203: D19.1 131.72,39.85 133.6,37.97 196.38,37.97 v2(196.63,38.23) ; v2(202.82,19.31) 202.42,18.91 142.38,18.91 141.12,20.17 D30.1 ; U44.40 112.46,11.66 114.91,11.66 119.65,16.4 208.8,16.4 209.12,16.72 v2(209.12,17.05) 209.14,17.07 209.14,20.36 204.79,24.72 204.79,33.19 206.16,34.57 207.82,34.57 v2(208.9,35.65) 208.9,36.72 207.52,38.1 204.87,38.1 200.76,42.21 200.76,50.63 204.63,54.5 207.17,54.5 207.9,55.23 207.9,56.27 207.17,57.01 128.16,57.01 126.64,58.52 D7.1
COL7: length 448.8
  Top Layer w0.203: v2(209.42,36.08) 209.42,36.09 209.42,36.7 207.39,38.73 196.21,38.73 v2(196.2,38.75) ; v2(212.99,15.68) 212.92,15.74 211.39,15.74 v2(209.64,17.49) 207.31,19.82 v2(202.38,19.82)
  Bottom Layer w0.203: D39.1 140.9,0.51 220.34,0.51 222.68,2.84 222.68,15.57 219.84,18.41 213.5,18.41 212.72,17.64 212.72,15.94 v2(212.99,15.68) ; D8.1 145.75,58.72 147.11,57.36 207.32,57.36 208.26,56.42 208.26,55.09 207.32,54.14 204.78,54.14 201.12,50.48 201.12,42.47 201.12,42.47 201.12,42.35 204.99,38.48 207.64,38.48 209.42,36.7 v2(209.42,36.08) 209.42,35.43 208.2,34.21 206.31,34.21 205.14,33.05 205.14,24.86 209.64,20.36 v2(209.64,17.49) 209.64,16.74 208.95,16.04 119.8,16.04 114.91,11.15 112.47,11.15 U44.41 ; D31.1 160.22,20.37 161.33,19.26 201.82,19.26 v2(202.38,19.82) ; v2(196.2,38.75) 195.78,38.33 151.54,38.33 150.83,39.04 D20.1
COL8: length 353.6
  Top Layer w0.203: v2(213.51,16.11) 213.44,16.18 211.91,16.18 v2(210.16,17.92) 207.74,20.34 v2(201.95,20.34) ; v2(195.76,39.27) 195.78,39.25 207.38,39.25 209.78,36.85 209.78,36.52
  Bottom Layer w0.203: U44.42 112.46,10.67 114.94,10.67 119.95,15.69 209.1,15.69 210.16,16.75 v2(210.16,17.92) 210.16,20.35 205.5,25.01 205.5,32.9 206.46,33.86 208.35,33.86 209.94,35.44 v2(209.94,36.52) 209.94,36.7 207.8,38.84 205.14,38.84 201.47,42.5 201.47,50.33 204.93,53.79 207.46,53.79 208.61,54.94 208.61,56.57 207.46,57.72 165.67,57.72 164.85,58.54 D9.1 ; v2(195.76,39.27) 195.18,38.68 170.87,38.68 169.93,39.62 D21.1 ; D40.1 176.59,1.97 177.7,0.86 220.2,0.86 222.33,2.99 222.33,15.42 219.69,18.06 213.64,18.06 213.08,17.5 213.08,16.54 v2(213.51,16.11) ; v2(201.95,20.34) 201.22,19.62 180.66,19.62 179.33,20.95 D32.1
COL9: length 274.5
  Top Layer w0.203: v2(195.32,39.79) 196.18,39.79 196.36,39.61 207.8,39.61 v2(210.45,36.95) ; v2(214.03,16.55) 213.96,16.62 212.43,16.62 v2(210.68,18.36) 208.18,20.86 v2(201.51,20.86)
  Bottom Layer w0.203: D41.1 198.3,2.23 199.31,1.22 220.05,1.22 221.97,3.14 221.97,15.28 219.54,17.7 213.79,17.7 213.44,17.35 213.44,17.14 v2(214.03,16.55) ; D22.1 189.03,39.7 189.69,39.04 194.58,39.04 v2(195.32,39.79) ; D10.1 183.95,59 184.88,58.07 207.61,58.07 208.97,56.71 208.97,54.79 207.61,53.43 205.08,53.43 201.83,50.19 201.83,42.65 205.29,39.19 208.2,39.19 210.44,36.95 v2(210.45,36.95) 210.45,35.45 208.5,33.5 206.6,33.5 205.85,32.75 205.85,25.16 210.19,20.83 210.19,20.83 210.68,20.34 v2(210.68,18.36) 210.68,16.77 209.25,15.33 120.11,15.33 114.94,10.16 112.46,10.16 U44.43 ; v2(201.51,20.86) 200.62,19.97 198.97,19.97 198.43,20.52 D33.1
COL10: length 205.5
  Top Layer w0.203: v2(211.2,18.8) 212.95,17.05 214.48,17.05 v2(214.55,16.98)
  Bottom Layer w0.203: v2(210.97,37.39) 210.97,35.46 208.66,33.15 206.75,33.15 206.21,32.61 206.21,25.31 211.2,20.32 v2(211.2,18.8) ; v2(210.97,37.39) 210.89,37.39 208.74,39.55 205.44,39.55 202.18,42.8 202.18,50.04 205.22,53.08 207.76,53.08 209.33,54.64 209.33,56.86 207.76,58.43 204.5,58.43 D11.1 ; v2(210.97,37.39) 211,37.39 214.5,40.89 D23.1 ; U44.45 112.48,9.19 114.47,9.19 120.25,14.98 209.39,14.98 211.2,16.78 v2(211.2,18.8) ; v2(211.2,18.8) 217.17,18.8 219.39,21.01 D34.1 ; D42.1 220.34,3.05 221.62,4.32 221.62,15.13 219.39,17.35 214.71,17.35 214.55,17.19 v2(214.55,16.98)
COL11: length 163.3
  Top Layer w0.203: v2(222.12,58.55) 222.12,13.97 219.07,10.92 210.44,10.92 209.55,11.81 209.55,14.99 209.17,15.37 129.79,15.37 v2(128.52,14.1)
  Bottom Layer w0.203: 112.46,8.66 114.42,8.64 119.88,14.1 v2(128.52,14.1) ; D12.1 222.12,59.84 v2(222.12,58.55)
D+: length 61.6
  Top Layer w0.203: U47.2 64.26,5.97 66.65,8.36 71.14,8.36 73.43,6.07 83.34,6.07 85.5,3.91 91.17,3.91 92.94,5.69 106.66,5.69 107.59,6.62 107.59,11.53 107.31,11.81 107.31,13.33 107.57,13.59 108.33,13.59 108.71,13.21 v2(108.71,12.95)
  Bottom Layer w0.203: v2(108.71,12.95) 109.45,13.7 U44.33 ; U47.2 64.02,5.96 R5.2
D-: length 61.4
  Top Layer w0.203: U47.3 66.8,6.22 66.8,7.11 67.69,8 70.99,8 73.28,5.72 73.73,5.72 73.93,5.51 73.93,4.52 74.14,4.32 75.26,4.32 75.46,4.52 75.46,5.51 75.66,5.72 76.78,5.72 76.98,5.51 76.98,4.52 77.19,4.32 78.3,4.32 78.51,4.52 78.51,5.51 78.71,5.72 79.83,5.72 80.03,5.51 80.03,4.52 80.23,4.32 81.35,4.32 81.55,4.52 81.55,5.51 81.76,5.72 83.19,5.72 85.34,3.56 91.31,3.56 93.09,5.33 106.81,5.33 107.95,6.48 v2(107.95,12.95)
  Bottom Layer w0.203: U44.32 108.95,13.96 v2(107.95,12.95)
NRST: length 14.1
  Bottom Layer w0.203: EN.1 96.97,4.51 97.6,3.88 99.5,3.88 100.2,3.17 101.86,3.17 R1.2 103.28,4.6 107.49,4.6 107.95,5.06 U44.7
OSC_IN: length 6.8
  Bottom Layer w0.203: U44.5 108.97,6.15 108.97,4.24 X1.2
  Bottom Layer w0.254: X1.2 111.49,3.88 112.78,3.88
OSC_OUT: length 6.8
  Bottom Layer w0.203: U44.6 108.46,6.16 108.46,4.7 106.55,2.79 X1.1
  Bottom Layer w0.254: X1.1 105.43,3.88 104.39,3.88
PB2: length 2.9
  Bottom Layer w0.203: U44.20 101.74,11.16 101.59,11.31 R4.2
RGB: length 161.4
  Top Layer w0.203: v2(3.3,69.47) 3.3,64.01 2.03,62.74 2.03,16.64 3.19,15.48 19.8,15.48 20.45,16.13 93.34,16.13 93.45,16.03 v2(106.02,16.03)
  Bottom Layer w0.203: U44.28 106.95,15.47 106.43,16 106.04,16 ; U1.4 4.58,69.47 v2(3.3,69.47)
ROW0: length 447.2
  Top Layer w0.203: v2(105.94,7.47) 105.18,7.47 101.51,11.14 23.07,11.14 19.98,8.05 v2(19.97,8.05)
  Bottom Layer w0.203: U8.5 138.1,60.26 141.24,60.26 142.64,61.65 142.64,63.56 143.66,64.58 145.18,64.58 146.32,63.43 146.32,61.27 147.35,60.24 U9.5 157.15,60.26 160.29,60.26 161.69,61.65 161.69,63.56 162.71,64.58 164.23,64.58 165.37,63.43 165.37,61.27 166.41,60.24 U10.5 176.2,60.26 179.34,60.26 180.74,61.65 180.74,63.56 181.76,64.58 183.28,64.58 184.42,63.43 184.42,61.27 185.45,60.24 U11.5 195.25,60.26 198.39,60.26 199.79,61.65 199.79,63.56 200.81,64.58 202.33,64.58 203.47,63.43 203.47,61.27 204.5,60.24 U12.5 ; v2(19.97,8.05) 19.98,8.05 20.32,8.38 20.32,8.93 17.25,12 17.25,13.74 15.51,15.47 7.78,15.47 4.72,18.53 4.72,34.54 6.74,36.55 12.72,36.55 14.14,37.97 14.76,37.97 17.04,40.25 17.04,52.46 15.16,54.34 15.16,57.74 14.48,58.42 6.48,58.42 U1.5 4.73,60.2 7.87,60.2 9.27,61.59 9.27,63.5 10.29,64.52 11.81,64.52 12.95,63.37 12.95,61.21 13.98,60.18 U2.5 23.78,60.2 26.92,60.2 28.32,61.59 28.32,63.5 29.34,64.52 30.86,64.52 32,63.37 32,61.21 33.04,60.18 U3.5 42.83,60.2 45.97,60.2 47.37,61.59 47.37,63.5 48.39,64.52 49.91,64.52 51.05,63.37 51.05,61.21 52.09,60.18 U4.5 61.88,60.2 65.02,60.2 66.42,61.59 66.42,63.5 67.44,64.52 68.96,64.52 70.1,63.37 70.1,61.21 71.13,60.18 U5.5 80.93,60.2 84.07,60.2 85.47,61.59 85.47,63.5 86.49,64.52 88.01,64.52 89.15,63.37 89.15,61.21 90.19,60.18 U6.5 99.98,60.2 103.12,60.2 104.52,61.59 104.52,63.5 105.54,64.52 107.06,64.52 108.2,63.37 108.2,61.21 109.23,60.18 118.89,60.18 118.91,60.2 122.05,60.2 123.45,61.59 123.45,63.5 124.47,64.52 125.99,64.52 127.13,63.37 127.13,61.21 128.16,60.18 137.94,60.18 ; U44.11 105.94,6.17 v2(105.94,7.47)
ROW1: length 392.5
  Top Layer w0.203: v2(105.41,8.89) 104.52,8.89 101.92,11.49 22.46,11.49 v2(19.54,8.56) ; v2(194.31,41.15) 207.01,41.15 U23.5 ; v2(15.88,43.81) v2(19.69,43.81)
  Bottom Layer w0.203: 123.74,41.12 113.96,41.12 112.93,42.15 112.93,44.31 111.78,45.45 110.26,45.45 109.24,44.44 109.24,42.53 107.85,41.13 104.7,41.13 ; U44.12 105.41,6.21 v2(105.41,8.89) ; U14.5 28.5,41.13 ; U14.5 31.66,41.15 33.06,42.55 33.06,44.45 34.07,45.47 35.6,45.47 36.74,44.32 36.74,42.17 37.77,41.13 47.55,41.13 U15.5 50.71,41.15 52.11,42.55 52.11,44.45 53.13,45.47 54.65,45.47 55.79,44.32 55.79,42.17 56.82,41.13 66.6,41.13 ; U14.5 22.35,41.15 v2(19.69,43.81) ; 104.7,41.13 104.69,41.12 ; 104.7,41.13 94.92,41.13 93.89,42.17 93.89,44.32 92.75,45.47 91.22,45.47 90.21,44.45 90.21,42.55 88.81,41.15 U17.5 85.65,41.13 ; 161.85,41.13 U21.5 165.01,41.15 166.41,42.55 166.41,44.45 167.42,45.47 168.95,45.47 170.09,44.32 170.09,42.17 171.12,41.13 180.9,41.13 U22.5 184.06,41.15 185.46,42.55 185.46,44.45 186.47,45.47 188,45.47 189.14,44.32 189.14,42.17 190.17,41.13 194.3,41.13 v2(194.31,41.15) ; v2(15.88,43.81) 14.22,45.47 12.32,45.47 7.99,41.13 U13.5 7,37.32 4.37,34.69 4.37,18.38 7.64,15.11 15.37,15.11 16.89,13.59 16.89,11.18 19.5,8.56 v2(19.54,8.56) ; 123.75,41.13 U19.5 126.91,41.15 128.31,42.55 128.31,44.45 129.32,45.47 130.85,45.47 131.99,44.32 131.99,42.17 133.02,41.13 142.8,41.13 U20.5 145.96,41.15 147.36,42.55 147.36,44.45 148.37,45.47 149.9,45.47 151.04,44.32 151.04,42.17 152.07,41.13 161.6,41.13 161.58,41.12 ; 66.6,41.13 69.75,41.13 71.14,42.53 71.14,44.44 72.16,45.45 73.68,45.45 74.83,44.31 74.83,42.15 75.86,41.12 85.64,41.12 ; 66.6,41.13 66.59,41.12
ROW2: length 378.5
  Top Layer w0.203: U34.5 211.84,22.1 v2(201.29,22.1) ; v2(106.8,13.14) 106.8,11.69 107.24,11.25 107.24,6.78 106.5,6.04 101.78,6.04 101.6,6.22 v2(101.6,6.48)
  Bottom Layer w0.203: v2(101.6,6.48) 101.6,6.98 102.28,7.66 U44.13 ; U25.5 41.19,22.06 42.58,23.45 42.58,25.36 43.6,26.38 45.12,26.38 46.27,25.23 46.27,23.07 47.3,22.04 57.08,22.04 U26.5 60.24,22.06 61.63,23.45 61.63,25.36 62.65,26.38 64.17,26.38 65.32,25.23 65.32,23.07 66.35,22.04 76.13,22.04 76.14,22.06 79.29,22.06 80.68,23.45 80.68,25.36 81.7,26.38 83.22,26.38 84.37,25.23 84.37,23.07 85.4,22.04 95.18,22.04 U28.5 98.34,22.06 99.73,23.45 99.73,25.36 100.75,26.38 102.27,26.38 103.42,25.23 103.42,23.07 104.45,22.04 114.23,22.04 U29.5 117.39,22.06 118.78,23.45 118.78,25.36 119.8,26.38 121.32,26.38 122.47,25.23 122.47,23.07 123.5,22.04 133.28,22.04 U30.5 136.44,22.06 137.83,23.45 137.83,25.36 138.85,26.38 140.37,26.38 141.52,25.23 141.52,23.07 142.55,22.04 152.33,22.04 U31.5 155.49,22.06 156.88,23.45 156.88,25.36 157.9,26.38 159.42,26.38 160.57,25.23 160.57,23.07 161.6,22.04 171.38,22.04 U32.5 174.54,22.06 175.93,23.45 175.93,25.36 176.95,26.38 178.47,26.38 179.62,25.23 179.62,23.07 180.65,22.04 190.43,22.04 U33.5 193.59,22.06 194.98,23.45 194.98,25.36 196,26.38 197.52,26.38 198.67,25.23 198.67,23.07 199.7,22.04 201.24,22.04 v2(201.29,22.1) ; U25.5 38.03,22.04 ; U25.5 31.91,22.06 29.36,24.61 20.73,24.61 19.05,26.29 17.27,26.29 13.07,22.08 U24.5 11.95,18.85 12.84,17.97 16.53,17.97 19.74,14.77 19.74,13.03 21.27,11.49 94.68,11.49 95.02,11.83 95.02,13.74 96.12,14.83 103.78,14.83 105.48,13.14 v2(106.8,13.14) 106.81,13.13
ROW3: length 215.3
  Top Layer w0.203: U35.5 U36.5 U37.5 U38.5 99.17,3.03 99.95,3.81 ; U42.5 190.64,3.16 U41.5 U40.5 U39.5 128.81,0.89 102.87,0.89 99.95,3.81 ; v2(99.95,4.83) 99.95,3.81
  Bottom Layer w0.203: v2(99.95,4.83) 99.95,7.49 100.62,8.16 U44.14
SWCLK: length 14.9
  Top Layer w0.203: H1.2 116.08,9.53 115.06,10.54 v2(115.06,12.95)
  Bottom Layer w0.203: v2(115.06,12.95) 114.85,13.16 U44.37
SWD: length 21.4
  Top Layer w0.203: H1.3 111.38,6.98 109.98,8.38 v2(109.98,13.46)
  Bottom Layer w0.203: U44.34 109.95,13.49 v2(109.98,13.46)
USART1_D: length 1.6
  Bottom Layer w0.203: U44.31 108.45,15.49 NOREF#8.2
USART1_M: length 1.6
  Bottom Layer w0.203: NOREF#9.1 107.95,15.49 U44.30
$1N412: length 3.4
  Bottom Layer w0.254: 11.06,62.72 11.06,61.32 D1.2
$1N436: length 14.4
  Bottom Layer w0.254: U2.4 23.63,69.47 17.02,69.47 15.38,71.1 U1.3
$1N912: length 3.4
  Bottom Layer w0.254: D2.2 30.11,61.26 30.11,62.72
$1N913: length 14.4
  Bottom Layer w0.254: U2.3 34.43,71.1 36.07,69.47 42.68,69.47 U3.4
$1N1213: length 3.4
  Bottom Layer w0.254: D3.2 49.16,61.21 49.16,62.72
$1N1214: length 14.4
  Bottom Layer w0.254: U4.4 61.73,69.47 55.12,69.47 53.48,71.1 U3.3
$1N1442: length 3.4
  Bottom Layer w0.254: 68.21,62.72 68.21,61.16 66.93,59.88
$1N1443: length 14.4
  Bottom Layer w0.254: U4.3 72.53,71.1 74.17,69.47 80.78,69.47 U5.4
$1N1677: length 3.4
  Bottom Layer w0.254: 87.26,62.72 87.26,61.1 D5.2
$1N1678: length 14.4
  Bottom Layer w0.254: U6.4 99.83,69.47 93.22,69.47 91.58,71.1 U5.3
$1N1918: length 3.3
  Bottom Layer w0.254: 106.31,62.72 106.31,61.05 105.14,59.88
$1N2984: length 3.2
  Bottom Layer w0.254: D13.2 13.35,41.85 13.35,43.67
$1N2985: length 16.9
  Top Layer w0.203: v2(19.94,52.07) v2(15.49,52.07)
  Bottom Layer w0.203: U14.4 28.41,50.47 21.54,50.47 v2(19.94,52.07) ; v2(15.49,52.07) 15.48,52.05 U13.3
$1N2986: length 3.3
  Bottom Layer w0.254: D14.2 34.87,41.84 U14.6
$1N2987: length 14.4
  Bottom Layer w0.254: U14.3 39.18,52.07 40.82,50.44 47.43,50.44 U15.4
$1N2988: length 3.3
  Bottom Layer w0.254: U15.6 53.92,41.79 D15.2
$1N2989: length 14.4
  Bottom Layer w0.254: U16.4 66.48,50.44 59.87,50.44 58.24,52.07 U15.3
$1N2990: length 3.3
  Bottom Layer w0.254: D16.2 72.97,41.74 U16.6
$1N2991: length 14.4
  Bottom Layer w0.254: U17.4 85.53,50.44 78.92,50.44 77.28,52.07 U16.3
$1N2992: length 3.3
  Bottom Layer w0.254: U17.6 92.02,41.68 D17.2
$1N2993: length 14.4
  Bottom Layer w0.254: U18.4 104.58,50.44 97.97,50.44 96.33,52.07 U17.3
$1N2994: length 3.3
  Bottom Layer w0.254: D18.2 111.07,41.63 U18.6
$1N4716: length 3
  Bottom Layer w0.254: D24.2 18.3,23.31 U24.6
$1N4717: length 21.4
  Bottom Layer w0.254: 37.94,31.38 37.93,31.37 24.26,31.37 22.62,33 U24.3
$1N4718: length 3.3
  Bottom Layer w0.254: D25.2 44.39,23 U25.6
$1N4719: length 14.4
  Bottom Layer w0.254: U26.4 56.95,31.34 50.35,31.34 48.71,32.98 U25.3
$1N4720: length 3.2
  Bottom Layer w0.254: U26.6 63.44,22.95 D26.2
$1N4721: length 14.4
  Bottom Layer w0.254: 76.04,31.38 76,31.34 69.4,31.34 67.76,32.98 62.32,32.98
$1N4722: length 3.2
  Bottom Layer w0.254: D27.2 82.49,22.9 U27.6
$1N4723: length 14.4
  Bottom Layer w0.254: U27.3 86.81,32.98 88.45,31.34 95.05,31.34 U28.4
$1N4724: length 3.2
  Bottom Layer w0.254: D28.2 101.54,22.85 U28.6
$1N4725: length 14.4
  Bottom Layer w0.254: U29.4 114.1,31.34 107.5,31.34 105.86,32.98 100.42,32.98
$1N4726: length 3.2
  Bottom Layer w0.254: D29.2 120.59,22.79 U29.6
$1N5992: length 3.1
  Bottom Layer w0.254: D35.2 13.35,4.01 U35.6
$1N5993: length 16.8
  Top Layer w0.203: v2(21.21,13.84) v2(15.37,13.84)
  Bottom Layer w0.203: v2(15.37,13.84) 15.26,13.95 12.23,13.95 ; v2(21.21,13.84) 22.73,13.84 24.22,12.35 U36.4
$1N5994: length 3.1
  Bottom Layer w0.254: D36.2 34.81,3.88 U36.6
$1N5995: length 16.9
  Bottom Layer w0.254: 49.88,12.37 49.83,12.32 40.77,12.32 39.13,13.95 33.7,13.95
$1N5996: length 3.2
  Bottom Layer w0.254: D37.2 56.28,3.75 U37.6
$1N5997: length 28.8
  Bottom Layer w0.254: 55.16,13.95 60.59,13.95 62.23,12.32 83.19,12.32 U38.4
$1N5998: length 3.2
  Bottom Layer w0.254: D38.2 89.68,3.37 U38.6
$1N13881: length 14.4
  Bottom Layer w0.254: 118.91,69.5 118.88,69.47 112.27,69.47 110.63,71.1 U6.3
$1N13882: length 3.4
  Bottom Layer w0.254: D7.2 125.38,61.02 U7.6
$1N14279: length 14.4
  Bottom Layer w0.254: U7.3 129.7,71.16 131.34,69.53 137.95,69.53 U8.4
$1N14280: length 3.4
  Bottom Layer w0.254: U8.6 144.43,60.96 143.35,59.88
$1N14913: length 3.3
  Bottom Layer w0.254: 163.48,62.78 163.48,60.91 D9.2
$1N15646: length 14.4
  Bottom Layer w0.254: U9.4 157,69.53 150.39,69.53 148.75,71.16 U8.3
$1N15975: length 3.3
  Bottom Layer w0.254: D10.2 182.53,60.86 U10.6
$1N15978: length 14.4
  Bottom Layer w0.254: U9.3 167.8,71.16 169.44,69.53 176.05,69.53 U10.4
$1N16388: length 3.3
  Bottom Layer w0.254: U11.6 201.58,60.81 D11.2
$1N16391: length 14.4
  Bottom Layer w0.254: U10.3 186.85,71.16 188.49,69.53 195.1,69.53 U11.4
$1N16807: length 3.3
  Bottom Layer w0.254: 220.63,62.78 220.63,60.75 219.76,59.88
$1N16810: length 14.4
  Bottom Layer w0.254: U12.4 214.15,69.53 207.54,69.53 205.9,71.16 U11.3
$1N18837: length 3.2
  Bottom Layer w0.254: U19.6 130.12,41.58 D19.2
$1N18974: length 14.4
  Bottom Layer w0.254: U18.3 115.38,52.07 117.02,50.44 123.63,50.44 U19.4
$1N19795: length 3.2
  Bottom Layer w0.254: 148.43,40.78 149.17,41.52 U20.6
$1N19798: length 14.4
  Bottom Layer w0.254: U19.3 134.43,52.07 136.07,50.44 142.68,50.44 U20.4
$1N20232: length 3.2
  Bottom Layer w0.254: U21.6 168.22,41.47 D21.2
$1N20235: length 14.4
  Bottom Layer w0.254: U21.4 161.73,50.44 155.12,50.44 153.48,52.07 U20.3
$1N20675: length 3.2
  Bottom Layer w0.254: U22.6 187.27,41.42 D22.2
$1N20678: length 14.4
  Bottom Layer w0.254: U21.3 172.53,52.07 174.17,50.44 180.78,50.44 U22.4
$1N21124: length 3.2
  Bottom Layer w0.254: D23.2 213.38,41.98 213.38,43.67
$1N21127: length 21.5
  Top Layer w0.203: v2(193.04,50.67) 193.29,50.42 v2(203.83,50.42)
  Bottom Layer w0.203: v2(193.04,50.67) 191.64,52.07 U22.3 ; U23.4 203.87,50.45 v2(203.83,50.42)
$1N22907: length 3.2
  Bottom Layer w0.254: U30.6 139.64,22.74 D30.2
$1N23590: length 14.4
  Bottom Layer w0.254: U30.4 133.15,31.34 126.55,31.34 124.91,32.98 U29.3
$1N23955: length 3.1
  Bottom Layer w0.254: D31.2 158.69,22.69 U31.6
$1N23958: length 14.4
  Bottom Layer w0.254: U31.4 152.2,31.34 145.6,31.34 143.96,32.98 U30.3
$1N24422: length 3.1
  Bottom Layer w0.254: U32.6 177.74,22.63 D32.2
$1N24425: length 14.4
  Bottom Layer w0.254: U31.3 163.01,32.98 164.65,31.34 171.25,31.34 U32.4
$1N24895: length 3.1
  Bottom Layer w0.254: 196.03,21.82 196.79,22.58 U33.6
$1N24898: length 14.4
  Bottom Layer w0.254: U33.4 190.3,31.34 183.7,31.34 182.06,32.98 U32.3
$1N25374: length 3.3
  Bottom Layer w0.254: D34.2 218.2,23.06 U34.6
$1N25377: length 16.7
  Top Layer w0.203: v2(201.17,31.5) v2(207.39,31.5)
  Bottom Layer w0.203: 195.67,32.98 199.68,32.98 v2(201.17,31.5) ; 211.75,31.4 211.66,31.5 v2(207.39,31.5)
$1N25859: length 3.4
  Bottom Layer w0.254: U39.6 137.3,3.37 136.47,2.54
$1N26612: length 44.4
  Top Layer w0.203: v2(93.6,13.59) 101.98,13.59 102.87,14.47 124.84,14.47 v2(127,12.32)
  Bottom Layer w0.203: 130.81,12.32 U39.4 ; 130.81,12.32 v2(127,12.32) ; 130.81,12.32 131.49,12.32 ; 88.56,13.95 93.23,13.95 v2(93.6,13.59)
$1N26997: length 3.2
  Bottom Layer w0.254: U40.6 175.4,4.14 D40.2
$1N27494: length 3.1
  Bottom Layer w0.254: D41.2 196.86,3.88 U41.6
$1N27497: length 16.9
  Bottom Layer w0.254: 174.28,13.95 179.72,13.95 181.36,12.32 190.41,12.32 190.47,12.37
$1N27997: length 3.1
  Bottom Layer w0.254: U42.6 218.2,4.01 D42.2
$1N28000: length 16.9
  Bottom Layer w0.254: 211.93,12.37 211.88,12.32 202.82,12.32 201.18,13.95 195.75,13.95
$1N28340: length 242.6
  Top Layer w0.203: v2(5.59,50.42) 3.56,50.42 2.39,51.59 2.39,62.59 3.66,63.86 3.66,67.16 4.57,68.07 219.96,68.07 220.98,69.09 v2(220.98,70.87)
  Bottom Layer w0.203: U13.4 6.86,50.42 v2(5.59,50.42) ; v2(220.98,70.87) 220.68,71.16 U12.3
